# EAGLE board fmc-host (EAGLE 8.3.2), part 1 of 3
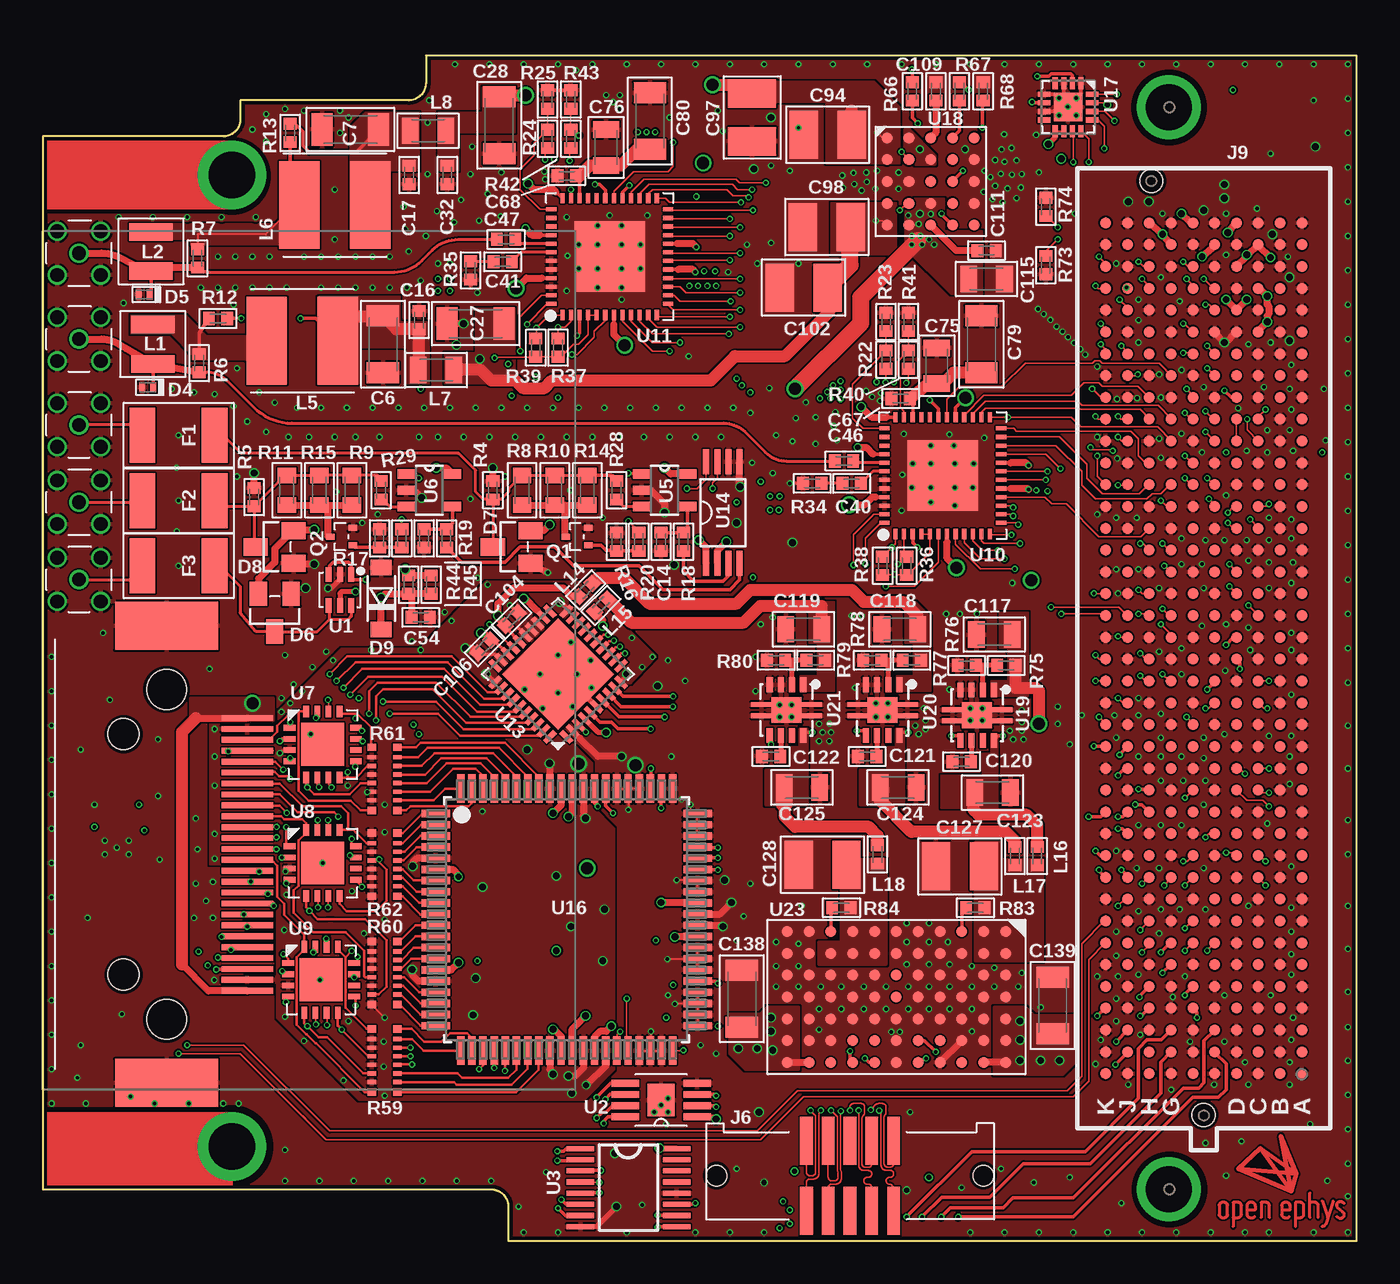
[diagram p9: board, top side]
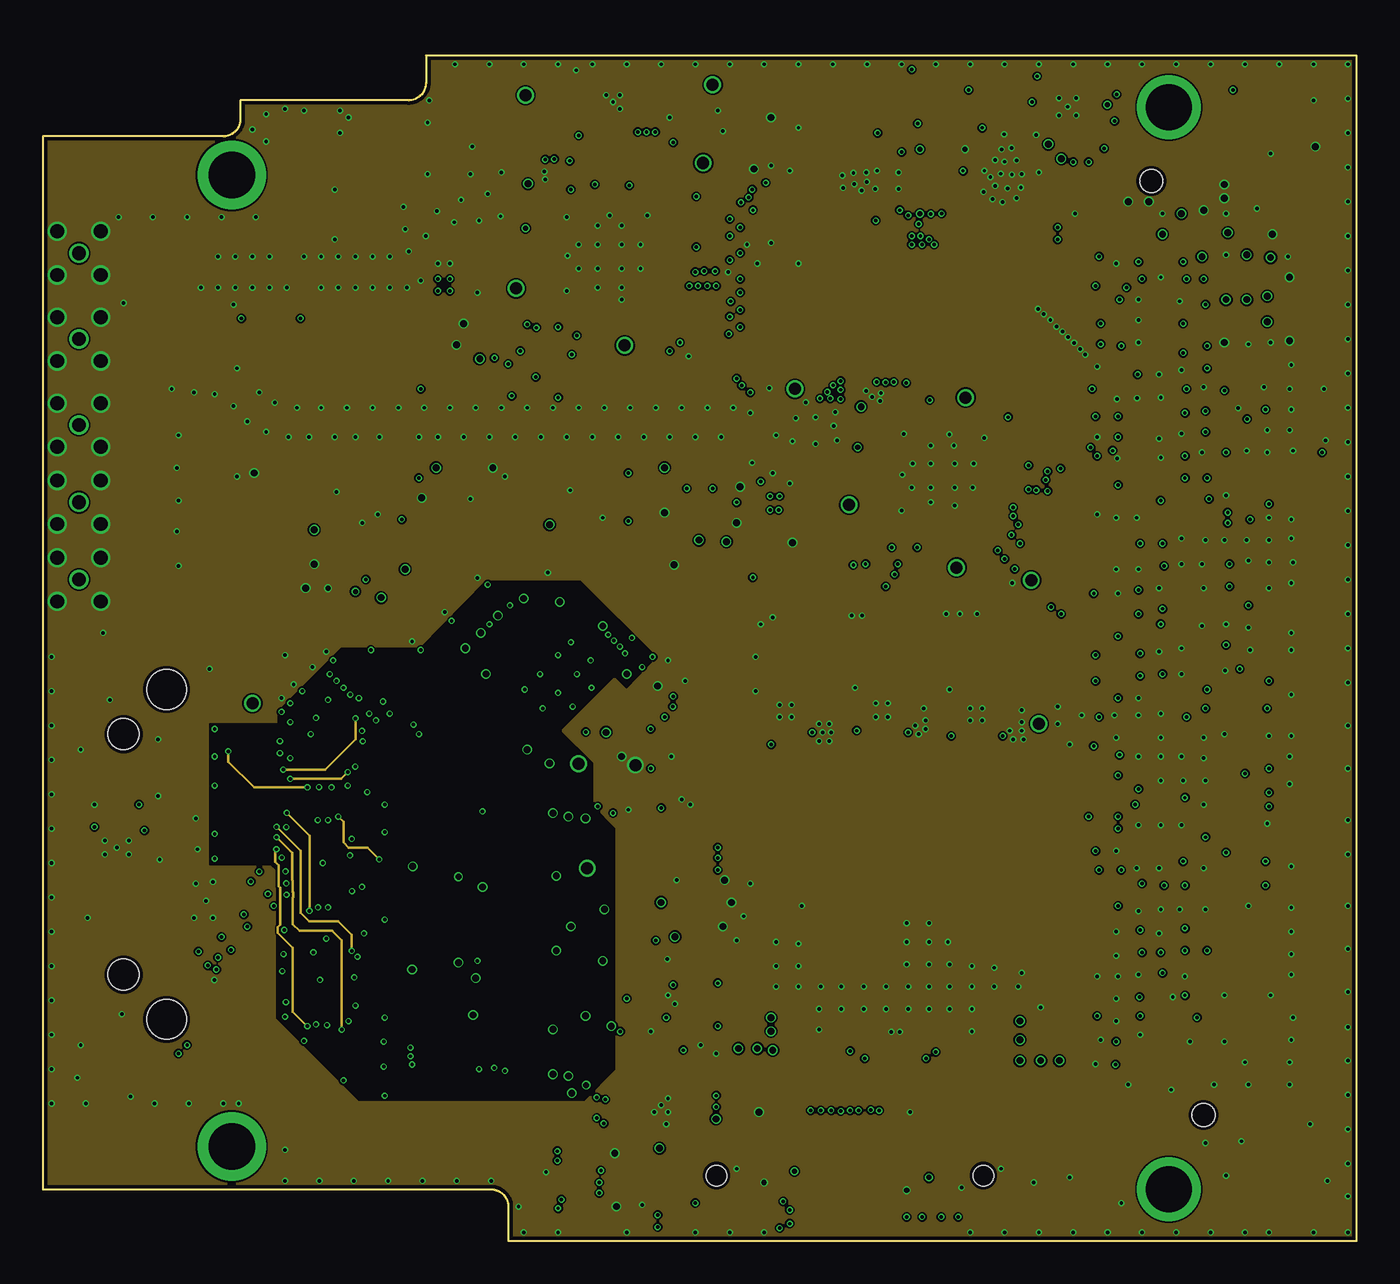
[diagram p10: board, inner layer GND1]
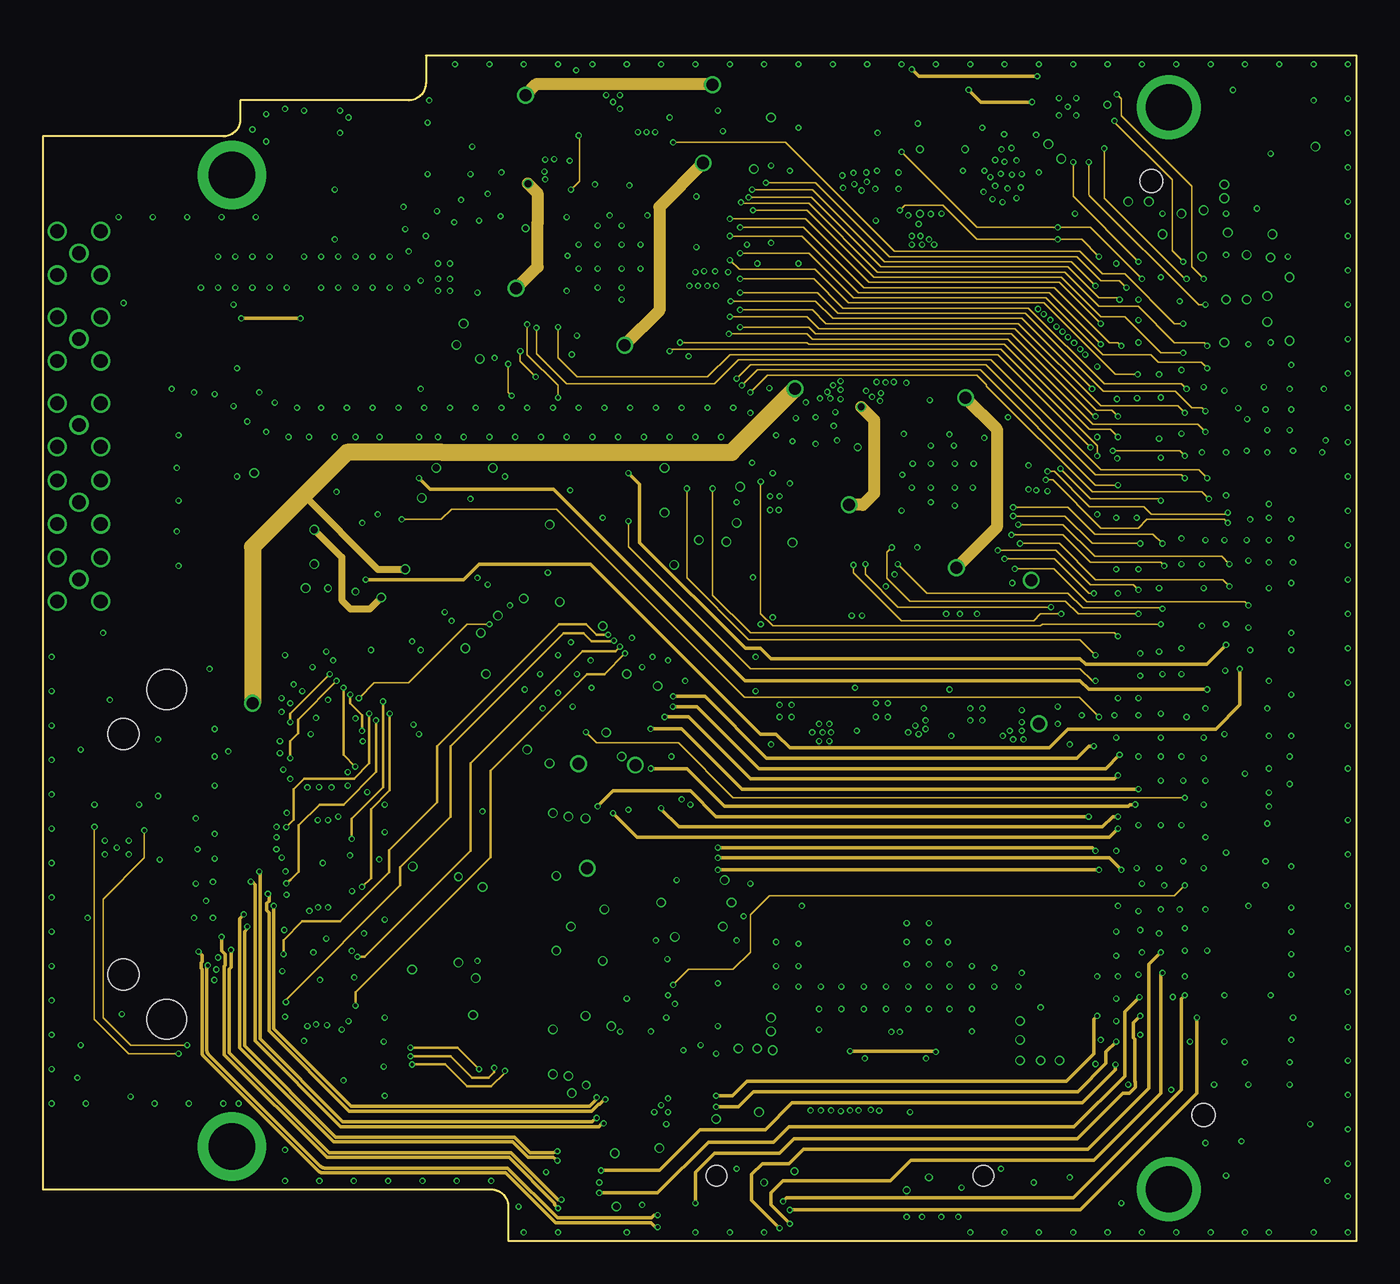
[diagram p11: board, inner layer Highspeed2]
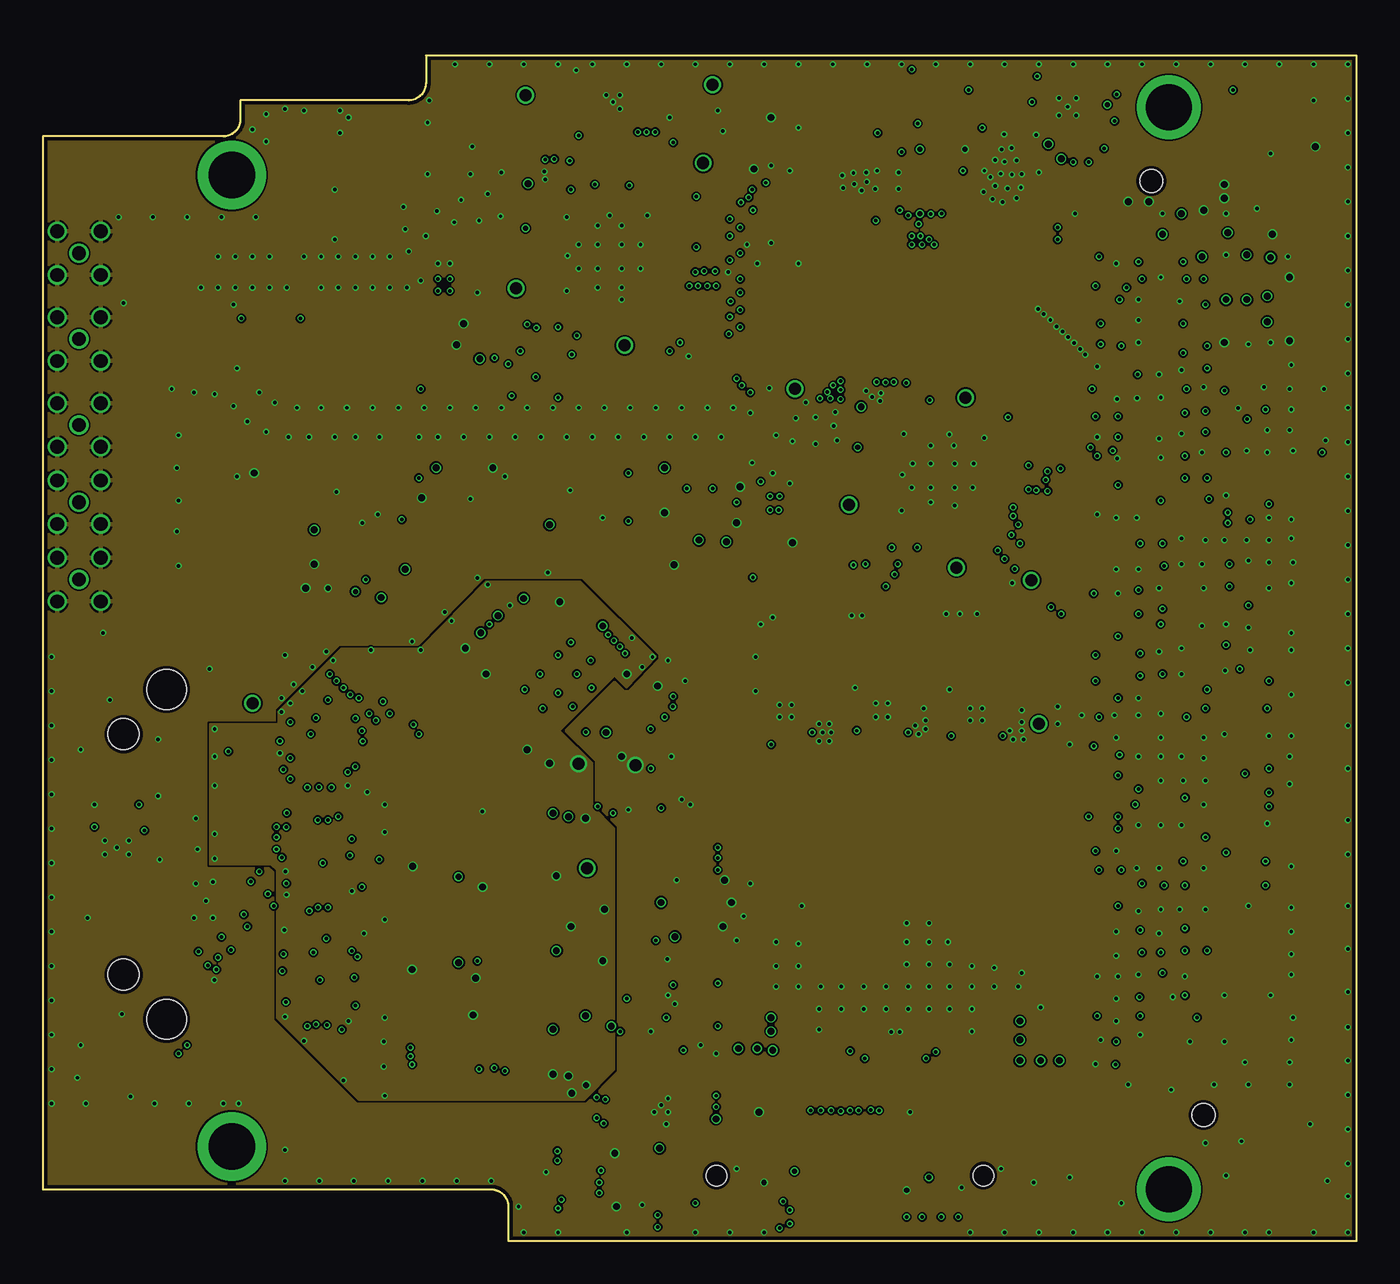
[diagram p12: board, inner layer GND3]
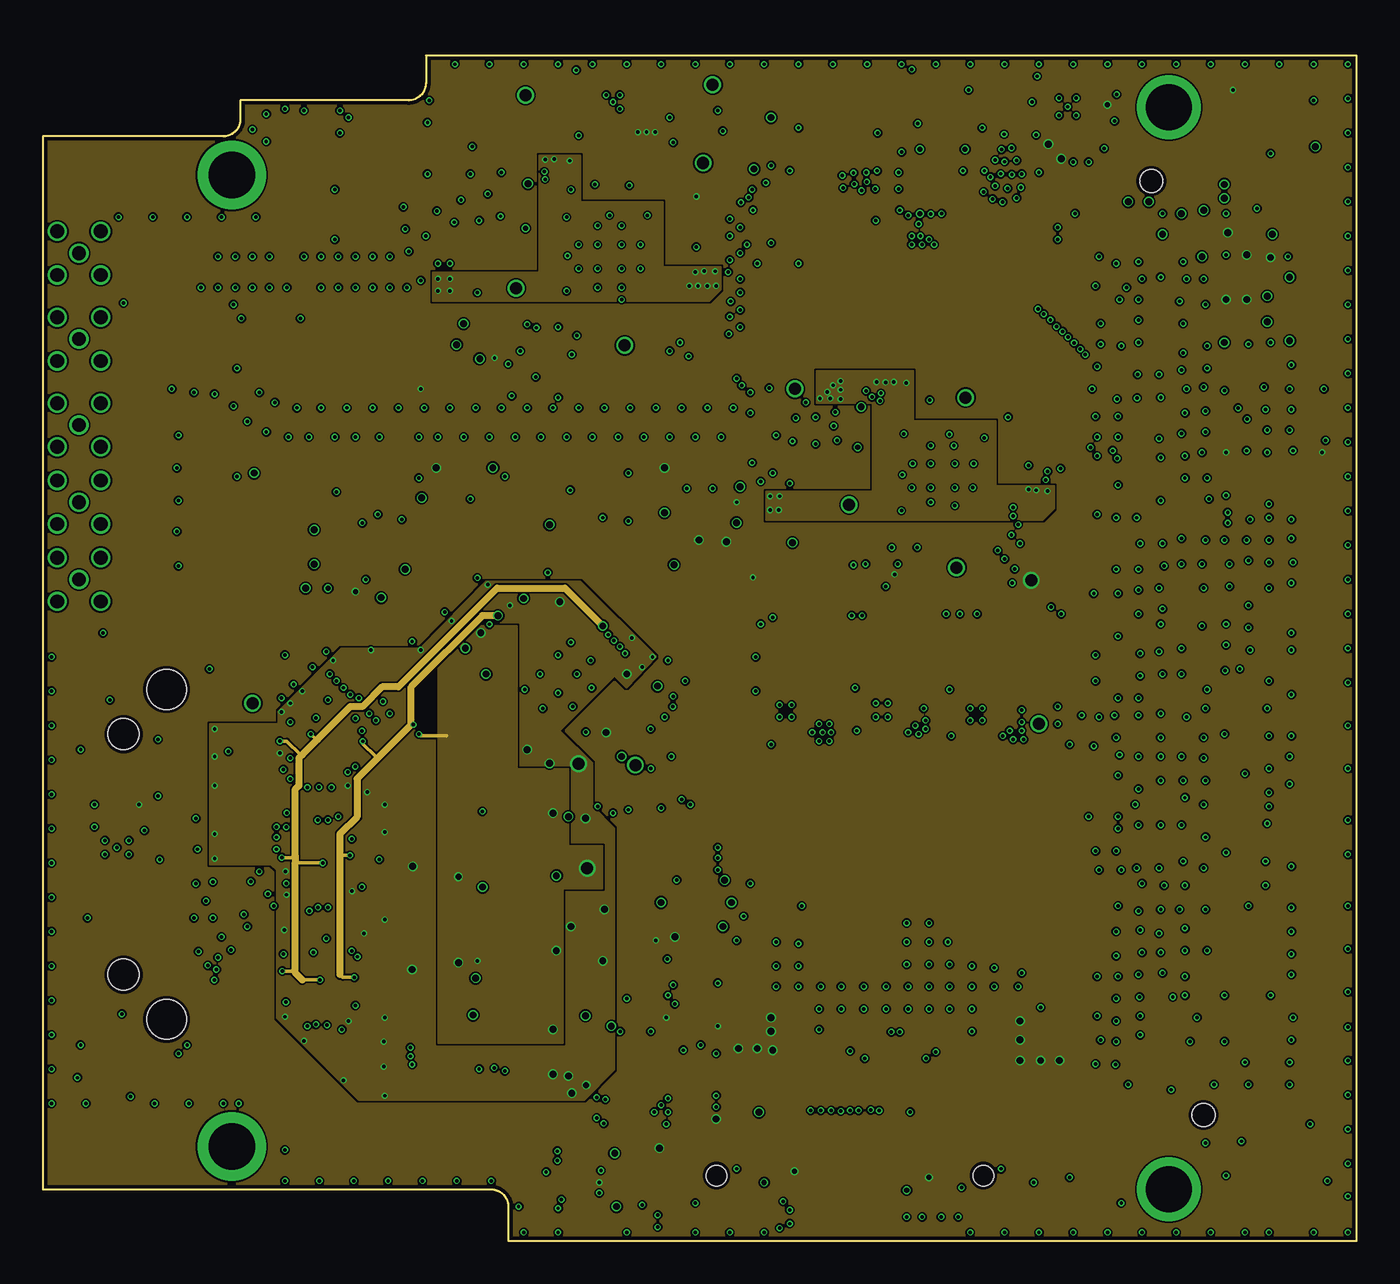
[diagram p13: board, inner layer VCC]
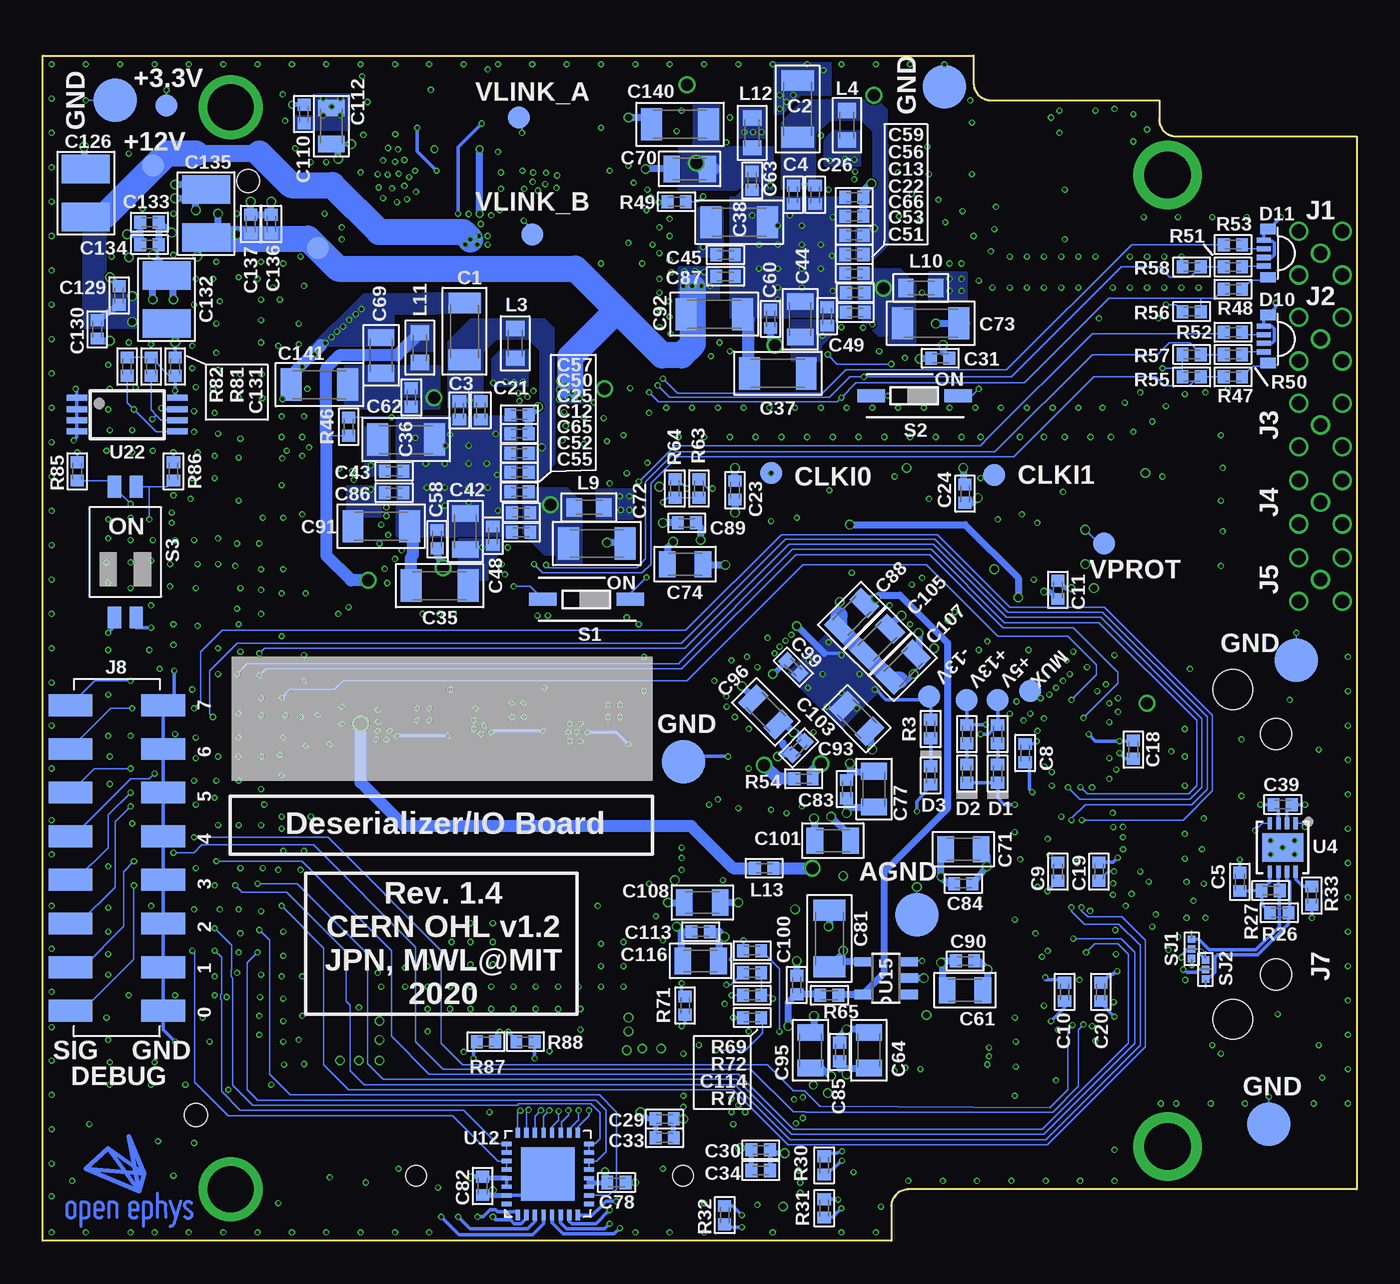
[diagram p14: board, bottom side, seen from below]

Size 76.5 x 69 mm. Coordinates in mm from the lower left corner, seen from the top.
Copper layers (1+2*3+4*5+16): Top/HighSpeed 0.035mm / dielectric 0.1mm / GND1 0.0175mm / dielectric 0.565mm / Highspeed2 0.0175mm / dielectric 5mil / GND3 0.0175mm / dielectric 0.565mm / VCC 0.0175mm / dielectric 0.1mm / Bottom/LowSpeed 0.035mm
Design rules "jlcpcb-6-layer *": minimum track width 3.5mil, minimum drill 0.2mm, track to track 3.5mil, track to pad 3.5mil, pad to pad 3.5mil, via to via 5mil, smd to smd 0mil, copper to edge 0.2mm, drill to drill 5mil, minimum pad ring 3mil, minimum via ring 3mil, stop-mask expansion 0mil, vias tented up to drill 100mil, thermal gap 0.12mm
Net classes: 1 130 Ohm Diff Top: width 0.09 mm, drill 0.2 mm, clearance 0.089 mm; 2 50 Ohm Single Top: width 0.15 mm, drill 0.2 mm; 3 100 Ohm Diff Mid: width 0.19 mm, drill 0.2 mm, clearance 0.09 mm; 4 50 Ohm Single Mid: width 0.2 mm, drill 0.2 mm; 5 100 Ohm Diff Top: width 0.15 mm, drill 0.2 mm, clearance 0.09 mm; 6 Link: width 0.15 mm, drill 0.2 mm, clearance 0.5 mm; 7 CAN 210 Diff Top: width 0.11 mm, drill 0.2 mm, clearance 0.09 mm
tRestrict: area -0.1,2.9 to 11.2,7.7; area 8.8,3.3 to 13.2,7.7; area 8.9,59.9 to 13.1,64.1; area -0.1,59.9 to 11.2,64.3; area 63.6,1 to 67.6,5; area 63.6,64 to 67.6,68

## Footprints (pad centres in the part's own frame; a part is rotated, then mirrored left to right if it is on the bottom)
1206 = smd 1.219 x 1.88: 1 -1.651,0; 2 1.651,0
0402 = smd 0.686 x 0.762: 1 -0.533,0; 2 0.533,0
0805 = smd 0.965 x 1.524: 1 -1.041,0; 2 1.041,0
1210 = smd 1.651 x 2.794: 1 -1.397,0; 2 1.397,0
LED-0402 = smd 0.762 x 0.686: A 0,-0.533; C 0,0.533
0402P-DFN = smd 0.35 x 0.6: A -0.325,0; C 0.325,0
SOT23 = smd 1 x 1.4: 1 -0.95,-1.1; 2 0.95,-1.1; 3 0,1.1
SOD123 = smd 0.914 x 1.219: A -1.8,0; C 1.8,0
RGB_LED_SMD-6 = smd 0.6 x 0.9: 1 1.4,0.65; 6 -1.4,0.65 | smd 0.3 x 0.8: 2 0.75,0.4; 3 0.25,0.4; 4 -0.25,0.4; 5 -0.75,0.4
1812 = smd 1.5 x 3.2: 1 -2.1,0; 2 2.1,0
MMCX-THRU = drill 0.8: GND@1 -1.27,1.27; GND@2 -1.27,-1.27; GND@3 1.27,-1.27; GND@4 1.27,1.27; SIG 0,0
ESHF-105-01-L-D-SM-K-TR = smd 0.74 x 2.8: 1 -2.54,-2.035; 2 -2.54,2.035; 3 -1.27,-2.035; 4 -1.27,2.035; 5 0,-2.035; 6 0,2.035; 7 1.27,-2.035; 8 1.27,2.035; 9 2.54,-2.035; 10 2.54,2.035 | hole 1.19: -7.77,0; 7.77,0
12226-82X0-00XX = smd 0.335 x 3: 1 7.938,7.2; 2 6.668,7.2; 3 5.397,7.2; 4 4.128,7.2; 5 2.857,7.2; 6 1.587,7.2; 7 0.318,7.2; 8 -0.953,7.2; 9 -2.223,7.2; 10 -3.493,7.2; 11 -4.763,7.2; 12 -6.032,7.2; 13 -7.303,7.2; 14 7.303,7.2; 15 6.032,7.2; 16 4.763,7.2; 17 3.493,7.2; 18 2.223,7.2; 19 0.953,7.2; 20 -0.318,7.2; 21 -1.587,7.2; 22 -2.857,7.2; 23 -4.128,7.2; 24 -5.397,7.2; 25 -6.668,7.2; 26 -7.938,7.2 | smd 2.8 x 6: PAD1 -13.3,2.5; PAD2 13.3,2.5 | hole 1.8: 7,0; -7,0 | hole 2.3: 9.6,2.5; -9.6,2.5
JP2X8_SMD = smd 1.27 x 2.54: 1 0,-2.7; 2 0,2.7; 3 2.54,-2.7; 4 2.54,2.7; 5 5.08,-2.7; 6 5.08,2.7; 7 7.62,-2.7; 8 7.62,2.7; 9 10.16,-2.7; 10 10.16,2.7; 11 12.7,-2.7; 12 12.7,2.7; 13 15.24,-2.7; 14 15.24,2.7; 15 17.78,-2.7; 16 17.78,2.7
FMC_HPC_MALE = smd 0.635 x 0.635: A1 24.765,5.715; A2 23.495,5.715; A3 22.225,5.715; A4 20.955,5.715; A5 19.685,5.715; A6 18.415,5.715; A7 17.145,5.715; A8 15.875,5.715; A9 14.605,5.715; A10 13.335,5.715; A11 12.065,5.715; A12 10.795,5.715; A13 9.525,5.715; A14 8.255,5.715; A15 6.985,5.715; A16 5.715,5.715; A17 4.445,5.715; A18 3.175,5.715; A19 1.905,5.715; A20 0.635,5.715; A21 -0.635,5.715; A22 -1.905,5.715; A23 -3.175,5.715; A24 -4.445,5.715; A25 -5.715,5.715; A26 -6.985,5.715; A27 -8.255,5.715; A28 -9.525,5.715; A29 -10.795,5.715; A30 -12.065,5.715; A31 -13.335,5.715; A32 -14.605,5.715; A33 -15.875,5.715; A34 -17.145,5.715; A35 -18.415,5.715; A36 -19.685,5.715; A37 -20.955,5.715; A38 -22.225,5.715; A39 -23.495,5.715; A40 -24.765,5.715; B1 24.765,4.445; B2 23.495,4.445; B3 22.225,4.445; B4 20.955,4.445; B5 19.685,4.445; B6 18.415,4.445; B7 17.145,4.445; B8 15.875,4.445; B9 14.605,4.445; B10 13.335,4.445; B11 12.065,4.445; B12 10.795,4.445; B13 9.525,4.445; B14 8.255,4.445; B15 6.985,4.445; B16 5.715,4.445; B17 4.445,4.445; B18 3.175,4.445; B19 1.905,4.445; B20 0.635,4.445; B21 -0.635,4.445; B22 -1.905,4.445; B23 -3.175,4.445; B24 -4.445,4.445; B25 -5.715,4.445; B26 -6.985,4.445; B27 -8.255,4.445; B28 -9.525,4.445; B29 -10.795,4.445; B30 -12.065,4.445; B31 -13.335,4.445; B32 -14.605,4.445; B33 -15.875,4.445; B34 -17.145,4.445; B35 -18.415,4.445; B36 -19.685,4.445; B37 -20.955,4.445; B38 -22.225,4.445; B39 -23.495,4.445; B40 -24.765,4.445; C1 24.765,3.175; C2 23.495,3.175; C3 22.225,3.175; C4 20.955,3.175; C5 19.685,3.175; C6 18.415,3.175; C7 17.145,3.175; C8 15.875,3.175; C9 14.605,3.175; C10 13.335,3.175; C11 12.065,3.175; C12 10.795,3.175; C13 9.525,3.175; C14 8.255,3.175; C15 6.985,3.175; C16 5.715,3.175; C17 4.445,3.175; C18 3.175,3.175; C19 1.905,3.175; C20 0.635,3.175; C21 -0.635,3.175; C22 -1.905,3.175; C23 -3.175,3.175; C24 -4.445,3.175; C25 -5.715,3.175; C26 -6.985,3.175; C27 -8.255,3.175; C28 -9.525,3.175; C29 -10.795,3.175; C30 -12.065,3.175; C31 -13.335,3.175; C32 -14.605,3.175; C33 -15.875,3.175; C34 -17.145,3.175; C35 -18.415,3.175; C36 -19.685,3.175; C37 -20.955,3.175; C38 -22.225,3.175; C39 -23.495,3.175; C40 -24.765,3.175; D1 24.765,1.905; D2 23.495,1.905; D3 22.225,1.905; D4 20.955,1.905; D5 19.685,1.905; D6 18.415,1.905; D7 17.145,1.905; D8 15.875,1.905; D9 14.605,1.905; D10 13.335,1.905; D11 12.065,1.905; D12 10.795,1.905; D13 9.525,1.905; D14 8.255,1.905; D15 6.985,1.905; D16 5.715,1.905; D17 4.445,1.905; D18 3.175,1.905; D19 1.905,1.905; D20 0.635,1.905; D21 -0.635,1.905; D22 -1.905,1.905; D23 -3.175,1.905; D24 -4.445,1.905; D25 -5.715,1.905; D26 -6.985,1.905; D27 -8.255,1.905; D28 -9.525,1.905; D29 -10.795,1.905; D30 -12.065,1.905; D31 -13.335,1.905; D32 -14.605,1.905; D33 -15.875,1.905; D34 -17.145,1.905; D35 -18.415,1.905; D36 -19.685,1.905; D37 -20.955,1.905; D38 -22.225,1.905; D39 -23.495,1.905; D40 -24.765,1.905; E1 24.765,0.635; E2 23.495,0.635; E3 22.225,0.635; E4 20.955,0.635; E5 19.685,0.635; E6 18.415,0.635; E7 17.145,0.635; E8 15.875,0.635; E9 14.605,0.635; E10 13.335,0.635; E11 12.065,0.635; E12 10.795,0.635; E13 9.525,0.635; E14 8.255,0.635; E15 6.985,0.635; E16 5.715,0.635; E17 4.445,0.635; E18 3.175,0.635; E19 1.905,0.635; E20 0.635,0.635; E21 -0.635,0.635; E22 -1.905,0.635; E23 -3.175,0.635; E24 -4.445,0.635; E25 -5.715,0.635; E26 -6.985,0.635; E27 -8.255,0.635; E28 -9.525,0.635; E29 -10.795,0.635; E30 -12.065,0.635; E31 -13.335,0.635; E32 -14.605,0.635; E33 -15.875,0.635; E34 -17.145,0.635; E35 -18.415,0.635; E36 -19.685,0.635; E37 -20.955,0.635; E38 -22.225,0.635; E39 -23.495,0.635; E40 -24.765,0.635; F1 24.765,-0.635; F2 23.495,-0.635; F3 22.225,-0.635; F4 20.955,-0.635; F5 19.685,-0.635; F6 18.415,-0.635; F7 17.145,-0.635; F8 15.875,-0.635; F9 14.605,-0.635; F10 13.335,-0.635; F11 12.065,-0.635; F12 10.795,-0.635; F13 9.525,-0.635; F14 8.255,-0.635; F15 6.985,-0.635; F16 5.715,-0.635; F17 4.445,-0.635; F18 3.175,-0.635; F19 1.905,-0.635; F20 0.635,-0.635; F21 -0.635,-0.635; F22 -1.905,-0.635; F23 -3.175,-0.635; F24 -4.445,-0.635; F25 -5.715,-0.635; F26 -6.985,-0.635; F27 -8.255,-0.635; F28 -9.525,-0.635; F29 -10.795,-0.635; F30 -12.065,-0.635; F31 -13.335,-0.635; F32 -14.605,-0.635; F33 -15.875,-0.635; F34 -17.145,-0.635; F35 -18.415,-0.635; F36 -19.685,-0.635; F37 -20.955,-0.635; F38 -22.225,-0.635; F39 -23.495,-0.635; F40 -24.765,-0.635; G1 24.765,-1.905; G2 23.495,-1.905; G3 22.225,-1.905; G4 20.955,-1.905; G5 19.685,-1.905; G6 18.415,-1.905; G7 17.145,-1.905; G8 15.875,-1.905; G9 14.605,-1.905; G10 13.335,-1.905; G11 12.065,-1.905; G12 10.795,-1.905; G13 9.525,-1.905; G14 8.255,-1.905; G15 6.985,-1.905; G16 5.715,-1.905; G17 4.445,-1.905; G18 3.175,-1.905; G19 1.905,-1.905; G20 0.635,-1.905; G21 -0.635,-1.905; G22 -1.905,-1.905; G23 -3.175,-1.905; G24 -4.445,-1.905; G25 -5.715,-1.905; G26 -6.985,-1.905; G27 -8.255,-1.905; G28 -9.525,-1.905; G29 -10.795,-1.905; G30 -12.065,-1.905; G31 -13.335,-1.905; G32 -14.605,-1.905; G33 -15.875,-1.905; G34 -17.145,-1.905; G35 -18.415,-1.905; G36 -19.685,-1.905; G37 -20.955,-1.905; G38 -22.225,-1.905; G39 -23.495,-1.905; G40 -24.765,-1.905; H1 24.765,-3.175; H2 23.495,-3.175; H3 22.225,-3.175; H4 20.955,-3.175; H5 19.685,-3.175; H6 18.415,-3.175; H7 17.145,-3.175; H8 15.875,-3.175; H9 14.605,-3.175; H10 13.335,-3.175; H11 12.065,-3.175; H12 10.795,-3.175; H13 9.525,-3.175; H14 8.255,-3.175; H15 6.985,-3.175; H16 5.715,-3.175; H17 4.445,-3.175; H18 3.175,-3.175; H19 1.905,-3.175; H20 0.635,-3.175; H21 -0.635,-3.175; H22 -1.905,-3.175; H23 -3.175,-3.175; H24 -4.445,-3.175; H25 -5.715,-3.175; H26 -6.985,-3.175; H27 -8.255,-3.175; H28 -9.525,-3.175; H29 -10.795,-3.175; H30 -12.065,-3.175; H31 -13.335,-3.175; H32 -14.605,-3.175; H33 -15.875,-3.175; H34 -17.145,-3.175; H35 -18.415,-3.175; H36 -19.685,-3.175; H37 -20.955,-3.175; H38 -22.225,-3.175; H39 -23.495,-3.175; H40 -24.765,-3.175; J1 24.765,-4.445; J2 23.495,-4.445; J3 22.225,-4.445; J4 20.955,-4.445; J5 19.685,-4.445; J6 18.415,-4.445; J7 17.145,-4.445; J8 15.875,-4.445; J9 14.605,-4.445; J10 13.335,-4.445; J11 12.065,-4.445; J12 10.795,-4.445; J13 9.525,-4.445; J14 8.255,-4.445; J15 6.985,-4.445; J16 5.715,-4.445; J17 4.445,-4.445; J18 3.175,-4.445; J19 1.905,-4.445; J20 0.635,-4.445; J21 -0.635,-4.445; J22 -1.905,-4.445; J23 -3.175,-4.445; J24 -4.445,-4.445; J25 -5.715,-4.445; J26 -6.985,-4.445; J27 -8.255,-4.445; J28 -9.525,-4.445; J29 -10.795,-4.445; J30 -12.065,-4.445; J31 -13.335,-4.445; J32 -14.605,-4.445; J33 -15.875,-4.445; J34 -17.145,-4.445; J35 -18.415,-4.445; J36 -19.685,-4.445; J37 -20.955,-4.445; J38 -22.225,-4.445; J39 -23.495,-4.445; J40 -24.765,-4.445; K1 24.765,-5.715; K2 23.495,-5.715; K3 22.225,-5.715; K4 20.955,-5.715; K5 19.685,-5.715; K6 18.415,-5.715; K7 17.145,-5.715; K8 15.875,-5.715; K9 14.605,-5.715; K10 13.335,-5.715; K11 12.065,-5.715; K12 10.795,-5.715; K13 9.525,-5.715; K14 8.255,-5.715; K15 6.985,-5.715; K16 5.715,-5.715; K17 4.445,-5.715; K18 3.175,-5.715; K19 1.905,-5.715; K20 0.635,-5.715; K21 -0.635,-5.715; K22 -1.905,-5.715; K23 -3.175,-5.715; K24 -4.445,-5.715; K25 -5.715,-5.715; K26 -6.985,-5.715; K27 -8.255,-5.715; K28 -9.525,-5.715; K29 -10.795,-5.715; K30 -12.065,-5.715; K31 -13.335,-5.715; K32 -14.605,-5.715; K33 -15.875,-5.715; K34 -17.145,-5.715; K35 -18.415,-5.715; K36 -19.685,-5.715; K37 -20.955,-5.715; K38 -22.225,-5.715; K39 -23.495,-5.715; K40 -24.765,-5.715 | drill 2.692: GNDA -31.496,-2.032; GNDB 31.496,-2.032 | hole 1.321: 27.165,0; -27.191,-3.05
1008PS = smd 2.54 x 1.016: 1 0,1.143; 2 0,-1.143
0603 = smd 0.889 x 1.067: 1 -0.864,0; 2 0.864,0
SRN6045TA = smd 5.1 x 2.35: 1 0,2.075; 2 0,-2.075
SC75 = smd 0.356 x 0.503: 1 -0.508,-0.65; 2 0.508,-0.65; 3 0,0.65
RN2X8-1506 = smd 0.425 x 0.5: 1 -1.837,-0.75; 8 1.837,-0.75; C1 -1.837,0.75; C8 1.837,0.75 | smd 0.25 x 0.5: 2 -1.25,-0.75; 3 -0.75,-0.75; 4 -0.25,-0.75; 5 0.25,-0.75; 6 0.75,-0.75; 7 1.25,-0.75; C2 -1.25,0.75; C3 -0.75,0.75; C4 -0.25,0.75; C5 0.25,0.75; C6 0.75,0.75; C7 1.25,0.75
DIP01-SMD-GULL = smd 0.76 x 1.6: 1 0,-5.08; 2 0,0
CHS-02TB = smd 0.76 x 1.27: 1 -0.635,-3.81; 2 0.635,-3.81; 3 0.635,3.81; 4 -0.635,3.81
SJ_2_0201 = smd 0.432 x 0.432: 1 -0.559,0; 2 0.559,0; COM 0,0
B1,27 = smd 1.27 x 1.27: TP 0,0
B2,54 = smd 2.54 x 2.54: TP 0,0
SC70 = smd 0.35 x 0.85: 1 -0.65,-0.9; 2 0,-0.9; 3 0.65,-0.9; 4 0.65,0.9; 5 0,0.9; 6 -0.65,0.9
MSOP-8-PAD-3X3 = smd 1.6 x 0.4: 1 -2.1,0.975; 2 -2.1,0.325; 3 -2.1,-0.325; 4 -2.1,-0.975; 5 2.1,-0.325; 6 2.1,-0.975; 7 2.1,0.325; 8 2.1,0.975 | smd 1.57 x 1.89: PAD 0,0
TSSOP-16 = smd 1.6 x 0.3: 1 -2.8,2.275; 2 -2.8,1.625; 3 -2.8,0.975; 4 -2.8,0.325; 5 -2.8,-0.325; 6 -2.8,-0.975; 7 -2.8,-1.625; 8 -2.8,-2.275; 9 2.8,-2.275; 10 2.8,-1.625; 11 2.8,-0.975; 12 2.8,-0.325; 13 2.8,0.325; 14 2.8,0.975; 15 2.8,1.625; 16 2.8,2.275
DFN83X3 = smd 0.7 x 0.25: 1 -1.4,0.75; 2 -1.4,0.25; 3 -1.4,-0.25; 4 -1.4,-0.75; 5 1.4,-0.75; 6 1.4,-0.25; 7 1.4,0.25; 8 1.4,0.75 | smd 1.65 x 2.38: PAD 0,0
SOT-23-5 = smd 0.55 x 1: 1 -0.95,-1.35; 2 0,-1.35; 3 0.95,-1.35; 4 0.95,1.35; 5 -0.95,1.35
QFN16-4X4MM = smd 0.686 x 0.33: 1 -1.925,0.975; 2 -1.925,0.325; 3 -1.925,-0.325; 4 -1.925,-0.975; 9 1.925,-0.975; 10 1.925,-0.325; 11 1.925,0.325; 12 1.925,0.975 | smd 0.33 x 0.686: 5 -0.975,-1.925; 6 -0.325,-1.925; 7 0.325,-1.925; 8 0.975,-1.925; 13 0.975,1.925; 14 0.325,1.925; 15 -0.325,1.925; 16 -0.975,1.925 | smd 2.5 x 2.5: PAD 0,0
WQFN48-7X7-PAD = smd 0.24 x 0.6: 1 2.75,3.4; 2 2.25,3.4; 3 1.75,3.4; 4 1.25,3.4; 5 0.75,3.4; 6 0.25,3.4; 7 -0.25,3.4; 8 -0.75,3.4; 9 -1.25,3.4; 10 -1.75,3.4; 11 -2.25,3.4; 12 -2.75,3.4; 25 -2.75,-3.4; 26 -2.25,-3.4; 27 -1.75,-3.4; 28 -1.25,-3.4; 29 -0.75,-3.4; 30 -0.25,-3.4; 31 0.25,-3.4; 32 0.75,-3.4; 33 1.25,-3.4; 34 1.75,-3.4; 35 2.25,-3.4; 36 2.75,-3.4 | smd 0.6 x 0.24: 13 -3.4,2.75; 14 -3.4,2.25; 15 -3.4,1.75; 16 -3.4,1.25; 17 -3.4,0.75; 18 -3.4,0.25; 19 -3.4,-0.25; 20 -3.4,-0.75; 21 -3.4,-1.25; 22 -3.4,-1.75; 23 -3.4,-2.25; 24 -3.4,-2.75; 37 3.4,-2.75; 38 3.4,-2.25; 39 3.4,-1.75; 40 3.4,-1.25; 41 3.4,-0.75; 42 3.4,-0.25; 43 3.4,0.25; 44 3.4,0.75; 45 3.4,1.25; 46 3.4,1.75; 47 3.4,2.25; 48 3.4,2.75 | smd 4.1 x 4.1: PAD 0,0
WQFN32-5X5 = smd 0.25 x 0.6: 1 1.75,2.4; 2 1.25,2.4; 3 0.75,2.4; 4 0.25,2.4; 5 -0.25,2.4; 6 -0.75,2.4; 7 -1.25,2.4; 8 -1.75,2.4; 17 -1.75,-2.4; 18 -1.25,-2.4; 19 -0.75,-2.4; 20 -0.25,-2.4; 21 0.25,-2.4; 22 0.75,-2.4; 23 1.25,-2.4; 24 1.75,-2.4 | smd 0.6 x 0.25: 9 -2.4,1.75; 10 -2.4,1.25; 11 -2.4,0.75; 12 -2.4,0.25; 13 -2.4,-0.25; 14 -2.4,-0.75; 15 -2.4,-1.25; 16 -2.4,-1.75; 25 2.4,-1.75; 26 2.4,-1.25; 27 2.4,-0.75; 28 2.4,-0.25; 29 2.4,0.25; 30 2.4,0.75; 31 2.4,1.25; 32 2.4,1.75 | smd 3.1 x 3.1: PAD 0,0
CP_40_7 = smd 0.855 x 0.3: 1 -2.927,2.25; 2 -2.927,1.75; 3 -2.927,1.25; 4 -2.927,0.75; 5 -2.927,0.25; 6 -2.927,-0.25; 7 -2.927,-0.75; 8 -2.927,-1.25; 9 -2.927,-1.75; 10 -2.927,-2.25; 21 2.927,-2.25; 22 2.927,-1.75; 23 2.927,-1.25; 24 2.927,-0.75; 25 2.927,-0.25; 26 2.927,0.25; 27 2.927,0.75; 28 2.927,1.25; 29 2.927,1.75; 30 2.927,2.25 | smd 0.3 x 0.855: 11 -2.25,-2.927; 12 -1.75,-2.927; 13 -1.25,-2.927; 14 -0.75,-2.927; 15 -0.25,-2.927; 16 0.25,-2.927; 17 0.75,-2.927; 18 1.25,-2.927; 19 1.75,-2.927; 20 2.25,-2.927; 31 2.25,2.927; 32 1.75,2.927; 33 1.25,2.927; 34 0.75,2.927; 35 0.25,2.927; 36 -0.25,2.927; 37 -0.75,2.927; 38 -1.25,2.927; 39 -1.75,2.927; 40 -2.25,2.927 | smd 4.6 x 4.6: PAD 0,0
TSSOP-8 = smd 0.348 x 1.45: 1 -0.973,-2.95; 2 -0.323,-2.95; 3 0.327,-2.95; 4 0.977,-2.95; 5 0.977,2.95; 6 0.327,2.95; 7 -0.323,2.95; 8 -0.973,2.95
ST_80_2 = smd 1.661 x 0.432: 1 -7.625,6.175; 2 -7.625,5.525; 3 -7.625,4.875; 4 -7.625,4.225; 5 -7.625,3.575; 6 -7.625,2.925; 7 -7.625,2.275; 8 -7.625,1.625; 9 -7.625,0.975; 10 -7.625,0.325; 11 -7.625,-0.325; 12 -7.625,-0.975; 13 -7.625,-1.625; 14 -7.625,-2.275; 15 -7.625,-2.925; 16 -7.625,-3.575; 17 -7.625,-4.225; 18 -7.625,-4.875; 19 -7.625,-5.525; 20 -7.625,-6.175; 41 7.625,-6.175; 42 7.625,-5.525; 43 7.625,-4.875; 44 7.625,-4.225; 45 7.625,-3.575; 46 7.625,-2.925; 47 7.625,-2.275; 48 7.625,-1.625; 49 7.625,-0.975; 50 7.625,-0.325; 51 7.625,0.325; 52 7.625,0.975; 53 7.625,1.625; 54 7.625,2.275; 55 7.625,2.925; 56 7.625,3.575; 57 7.625,4.225; 58 7.625,4.875; 59 7.625,5.525; 60 7.625,6.175 | smd 0.432 x 1.661: 21 -6.175,-7.625; 22 -5.525,-7.625; 23 -4.875,-7.625; 24 -4.225,-7.625; 25 -3.575,-7.625; 26 -2.925,-7.625; 27 -2.275,-7.625; 28 -1.625,-7.625; 29 -0.975,-7.625; 30 -0.325,-7.625; 31 0.325,-7.625; 32 0.975,-7.625; 33 1.625,-7.625; 34 2.275,-7.625; 35 2.925,-7.625; 36 3.575,-7.625; 37 4.225,-7.625; 38 4.875,-7.625; 39 5.525,-7.625; 40 6.175,-7.625; 61 6.175,7.625; 62 5.525,7.625; 63 4.875,7.625; 64 4.225,7.625; 65 3.575,7.625; 66 2.925,7.625; 67 2.275,7.625; 68 1.625,7.625; 69 0.975,7.625; 70 0.325,7.625; 71 -0.325,7.625; 72 -0.975,7.625; 73 -1.625,7.625; 74 -2.275,7.625; 75 -2.925,7.625; 76 -3.575,7.625; 77 -4.225,7.625; 78 -4.875,7.625; 79 -5.525,7.625; 80 -6.175,7.625
CP_16_27-L = smd 0.711 x 0.305: 1 -1.397,0.75; 2 -1.397,0.25; 3 -1.397,-0.25; 4 -1.397,-0.75; 9 1.397,-0.75; 10 1.397,-0.25; 11 1.397,0.25; 12 1.397,0.75 | smd 0.305 x 0.711: 5 -0.75,-1.397; 6 -0.25,-1.397; 7 0.25,-1.397; 8 0.75,-1.397; 13 0.75,1.397; 14 0.25,1.397; 15 -0.25,1.397; 16 -0.75,1.397 | smd 1.651 x 1.651: PAD 0,0
BGA_5X5_625X625 = smd 0.635 x 0.635: A1 -2.54,2.54; A2 -1.27,2.54; A3 0,2.54; A4 1.27,2.54; A5 2.54,2.54; B1 -2.54,1.27; B2 -1.27,1.27; B3 0,1.27; B4 1.27,1.27; B5 2.54,1.27; C1 -2.54,0; C2 -1.27,0; C3 0,0; C4 1.27,0; C5 2.54,0; D1 -2.54,-1.27; D2 -1.27,-1.27; D3 0,-1.27; D4 1.27,-1.27; D5 2.54,-1.27; E1 -2.54,-2.54; E2 -1.27,-2.54; E3 0,-2.54; E4 1.27,-2.54; E5 2.54,-2.54
PVSON-N8+4-3X3 = smd 0.85 x 0.35: 1 -1.475,0.975; 2 -1.475,0.325; 3 -1.475,-0.325; 4 -1.475,-0.975; 5 1.475,-0.975; 6 1.475,-0.325; 7 1.475,0.325; 8 1.475,0.975 | smd 1.5 x 1.75: PAD1 0,0 | smd 0.28 x 1.205: PAD2 -0.325,-1.45; PAD3 -0.325,1.45; PAD4 0.325,1.45; PAD5 0.325,-1.45
TSSOP8 = smd 0.35 x 1.2: 1 -0.975,-2.925; 2 -0.325,-2.925; 3 0.325,-2.925; 4 0.975,-2.925; 5 0.975,2.925; 6 0.325,2.925; 7 -0.325,2.925; 8 -0.975,2.925
LTM8049 = smd 0.63 x 0.63: A1 -3.81,6.35; A2 -2.54,6.35; A3 -1.27,6.35; A4 0,6.35; A5 1.27,6.35; A6 2.54,6.35; A7 3.81,6.35; B1 -3.81,5.08; B2 -2.54,5.08; B3 -1.27,5.08; B4 0,5.08; B5 1.27,5.08; B6 2.54,5.08; B7 3.81,5.08; C1 -3.81,3.81; C2 -2.54,3.81; C3 -1.27,3.81; C4 0,3.81; C5 1.27,3.81; C6 2.54,3.81; C7 3.81,3.81; D1 -3.81,2.54; D2 -2.54,2.54; D3 -1.27,2.54; D4 0,2.54; D5 1.27,2.54; D6 2.54,2.54; D7 3.81,2.54; E1 -3.81,1.27; E2 -2.54,1.27; E3 -1.27,1.27; E4 0,1.27; E5 1.27,1.27; E6 2.54,1.27; E7 3.81,1.27; F1 -3.81,0; F2 -2.54,0; F3 -1.27,0; F4 0,0; F5 1.27,0; F6 2.54,0; F7 3.81,0; G1 -3.81,-1.27; G2 -2.54,-1.27; G3 -1.27,-1.27; G4 0,-1.27; G5 1.27,-1.27; G6 2.54,-1.27; G7 3.81,-1.27; H1 -3.81,-2.54; H2 -2.54,-2.54; H3 -1.27,-2.54; H4 0,-2.54; H5 1.27,-2.54; H6 2.54,-2.54; H7 3.81,-2.54; J1 -3.81,-3.81; J2 -2.54,-3.81; J3 -1.27,-3.81; J4 0,-3.81; J5 1.27,-3.81; J6 2.54,-3.81; J7 3.81,-3.81; K1 -3.81,-5.08; K2 -2.54,-5.08; K3 -1.27,-5.08; K4 0,-5.08; K5 1.27,-5.08; K6 2.54,-5.08; K7 3.81,-5.08; L1 -3.81,-6.35; L2 -2.54,-6.35; L3 -1.27,-6.35; L4 0,-6.35; L5 1.27,-6.35; L6 2.54,-6.35; L7 3.81,-6.35
FMC_SINGLE_WIDTH_MODULE = drill 2.7 pad 4: BEZ1 -54.6,59.05; BEZ2 -54.6,2.5

## Placement (x,y rotation side)
C1  10uF  [1206]  51.95,52.95 270 bottom
C2  10uF  [1206]  32.55,65.9 270 bottom
C3  0.1uF  [0402]  52.25,48.35 90 bottom
C4  0.1uF  [0402]  32.8,60.9 90 bottom
C5  4.7nF  [0402]  6.8,20.9 90 bottom
C6  10uF  [1206]  19.8,52.2 90 top
C7  10uF  [1206]  17.9,64.7 0 top
C8  0.1uF  [0402]  19.3,28.4 90 bottom
C9  0.1uF  [0402]  17.4,21.5 90 bottom
C10  0.1uF  [0402]  17,14.5 90 bottom
C11  0.1uF  [0402]  17.4,37.9 270 bottom
C12  10nF  [0402]  48.75,44.75 0 bottom
C13  10nF  [0402]  29.25,58.55 0 bottom
C14  0.1uF  [0402]  36,40.7 270 top
C15  0.1uF  [0402]  22.2,40.9 270 top
C16  0.1uF  [0402]  21.9,53.6 90 top
C17  0.1uF  [0402]  21.33,62.05 270 top
C18  0.1uF  [0402]  13,28.6 90 bottom
C19  0.1uF  [0402]  15,21.5 90 bottom
C20  0.1uF  [0402]  14.9,14.5 90 bottom
C21  10nF  [0402]  51,48.35 90 bottom
C22  10nF  [0402]  29.25,57.42 0 bottom
C23  0.1uF  [0402]  36.2,43.7 270 bottom
C24  0.1uF  [0402]  22.8,43.5 270 bottom
C25  10nF  [0402]  48.75,45.85 0 bottom
C26  10nF  [0402]  31.52,60.9 90 bottom
C27  10uF  [1206]  25.2,53.4 0 top
C28  10uF  [1206]  26.57,64.95 90 top
C29  4.7nF  [0402]  40.3,7.1 180 bottom
C30  4.7nF  [0402]  34.7,5.3 0 bottom
C31  0.1uF  [0402]  24.24,51.38 0 bottom
C32  0.1uF  [0402]  23.55,62.05 270 top
C33  0.1uF  [0402]  40.3,6 180 bottom
C34  0.1uF  [0402]  34.7,4.1 0 bottom
C35  10uF  [1206]  53.4,38.15 0 bottom
C36  10uF  [1206]  55.35,46.65 180 bottom
C37  10uF  [1206]  33.7,50.5 0 bottom
C38  10uF  [1206]  35.95,59.3 180 bottom
C39  0.1uF  [0402]  4.3,25.4 0 bottom
C40  47nF  [0402]  47.1,44.1 180 top
C41  47nF  [0402]  26.77,57 180 top
C42  1uF  [0805]  51.9,41.3 270 bottom
C43  0.1uF  [0402]  56.05,44.8 180 bottom
C44  1uF  [0805]  32.4,53.65 270 bottom
C45  0.1uF  [0402]  36.75,57.4 180 bottom
C46  0.1uF  [0402]  46.65,45.4 180 top
C47  0.1uF  [0402]  26.97,58.3 180 top
C48  0.1uF  [0402]  50.3,41.05 270 bottom
C49  0.1uF  [0402]  30.83,53.83 270 bottom
C50  0.1uF  [0402]  48.75,47 0 bottom
C51  0.1uF  [0402]  29.2,54.05 0 bottom
C52  10nF  [0402]  48.65,42.4 0 bottom
C53  10nF  [0402]  29.2,55.2 0 bottom
C54  0.1uF  [0402]  22,36.3 180 top
C55  0.1uF  [0402]  48.65,41.25 0 bottom
C56  0.1uF  [0402]  29.25,59.65 0 bottom
C57  10nF  [0402]  48.75,48.1 0 bottom
C58  0.1uF  [0402]  53.55,40.85 270 bottom
C59  10nF  [0402]  29.25,60.75 0 bottom
C60  0.1uF  [0402]  34.12,53.67 270 bottom
C61  10uF  [0805]  22.8,14.6 180 bottom
C62  0.1uF  [0402]  55.05,49.1 90 bottom
C63  0.1uF  [0402]  35.2,61.72 90 bottom
C64  10uF  [0805]  28.4,11.1 90 bottom
C65  0.1uF  [0402]  48.75,43.6 0 bottom
C66  0.1uF  [0402]  29.25,56.33 0 bottom
C67  0.1uF  [0402]  49.95,49.04 0 top
C68  0.1uF  [0402]  30.5,62 0 top
C69  1uF  [0805]  56.8,51.55 270 bottom
C70  1uF  [0805]  38.84,62.41 0 bottom
C71  10uF  [0805]  22.9,22.8 180 bottom
C72  10uF  [1206]  44.25,40.6 180 bottom
C73  10uF  [1206]  24.8,53.42 180 bottom
C74  1uF  [0805]  39.1,39.4 180 bottom
C75  1uF  [0805]  52.05,50.95 270 top
C76  1uF  [0805]  32.8,63.65 270 top
C77  10uF  [0805]  28.1,26.3 270 bottom
C78  0.1uF  [0402]  43.1,3.4 180 bottom
C79  10uF  [1206]  54.65,52.2 270 top
C80  10uF  [1206]  35.35,65.2 270 top
C81  10uF  [1206]  30.7,17.6 90 bottom
C82  10nF  [0402]  50.9,3.2 90 bottom
C83  0.1uF  [0402]  29.7,26.3 270 bottom
C84  0.1uF  [0402]  22.9,20.8 180 bottom
C85  0.1uF  [0402]  30.1,11 90 bottom
C86  0.1uF  [0402]  56.05,43.55 180 bottom
C87  0.1uF  [0402]  36.75,56.15 180 bottom
C88  1uF  [0805]  29.4,36.4 45 bottom
C89  0.1uF  [0402]  39,41.8 0 bottom
C90  0.1uF  [0402]  22.8,16.3 180 bottom
C91  10uF  [1206]  56.8,41.6 180 bottom
C92  10uF  [1206]  37.4,53.95 180 bottom
C93  0.1uF  [0402]  32.5,28.7 45 bottom
C94  47uF  [1210]  45.7,64.4 0 top
C95  10uF  [0805]  31.8,11.1 90 bottom
C96  10uF  [0805]  34.4,30.8 315 bottom
C97  47uF  [1210]  41.3,65.4 90 top
C98  47uF  [1210]  45.65,59.02 0 top
C99  0.1uF  [0402]  32.8,33.4 315 bottom
C100  0.1uF  [0402]  32.6,14.9 270 bottom
C101  10uF  [0805]  30.5,23.3 0 bottom
C102  47uF  [1210]  44.3,55.5 0 top
C103  10uF  [0805]  29.1,30.4 135 bottom
C104  0.1uF  [0402]  27.3,36.2 225 top
C105  10uF  [0805]  27.9,34.9 45 bottom
C106  0.1uF  [0402]  25.7,34.6 45 top
C107  10uF  [0805]  26.4,33.4 45 bottom
C108  10uF  [0805]  38.1,19.7 0 bottom
C109  0.1uF  [0402]  52,66.92 270 top
C110  0.1uF  [0402]  61.3,65.6 90 bottom
C111  0.1uF  [0402]  54.95,57.65 180 top
C112  10uF  [0805]  59.7,64.9 270 bottom
C113  0.1uF  [0402]  38.2,18 0 bottom
C114  0.1uF  [0402]  35.2,14.3 180 bottom
C115  10uF  [0805]  54.95,56 180 top
C116  10uF  [0805]  38.2,16.3 0 bottom
C117  10uF  [0805]  55.4,35.3 0 top
C118  10uF  [0805]  49.9,35.6 0 top
C119  10uF  [0805]  44.3,35.6 0 top
C120  10nF  [0402]  53.5,27.9 180 top
C121  10nF  [0402]  48,28.2 180 top
C122  10nF  [0402]  42.4,28.2 180 top
C123  10uF  [0805]  55.3,26.1 180 top
C124  10uF  [0805]  49.8,26.4 180 top
C125  10uF  [0805]  44.2,26.4 180 top
C126  47uF  [1210]  74,61 270 bottom
C127  47uF  [1210]  53.4,21.8 0 top
C128  47uF  [1210]  45.4,21.9 180 top
C129  0.1uF  [0402]  72.07,55.03 270 bottom
C130  0.1uF  [0402]  73.33,53.07 90 bottom
C131  0.1uF  [0402]  68.8,50.9 270 bottom
C132  47uF  [1210]  69.3,54.8 90 bottom
C133  0.1uF  [0402]  70.3,59.3 0 bottom
C134  0.1uF  [0402]  70.3,58 0 bottom
C135  47uF  [1210]  67,59.8 270 bottom
C136  0.1uF  [0402]  63.2,59.2 270 bottom
C137  0.1uF  [0402]  64.4,59.2 270 bottom
C138  10uF  [1206]  40.7,14.1 90 top
C139  10uF  [1206]  58.8,13.7 90 top
C140  10uF  [1206]  39.4,65 0 bottom
C141  10uF  [1206]  60.4,49.85 0 bottom
D1  HSMG-C280  [LED-0402]  20.9,27.2 180 bottom
D2  HSMG-C280  [LED-0402]  22.7,27.2 180 bottom
D3  HSMG-C280  [LED-0402]  24.8,27.1 0 bottom
D4  SESD0402X1UN-0020-090  [0402P-DFN]  6.1,49.7 0 top
D5  SESD0402X1UN-0020-090  [0402P-DFN]  5.9,55.1 0 top
D6  BAR66  [SOT23]  13.5,36.57 180 top
D7  BAR66  [SOT23]  27.3,40.4 90 top
D8  BAR66  [SOT23]  13.5,40.4 90 top
D9  KDZ4.3B  [SOD123]  19.7,37.4 270 top
D10  APFA3011-AK13/F  [RGB_LED_SMD-6]  5.8,52.5 270 bottom
D11  APFA3011-AK13/F  [RGB_LED_SMD-6]  5.8,57.5 270 bottom
F1  C014F-2  [1812]  7.9,46.9 0 top
F2  C014F-2  [1812]  7.9,43.1 0 top
F3  C014F-2  [1812]  7.9,39.3 0 top
J1  SMA002  [MMCX-THRU]  2.1,57.5 90 top
J2  SMA002  [MMCX-THRU]  2.1,52.5 90 top
J3  SMA002  [MMCX-THRU]  2.1,47.5 90 top
J4  SMA002  [MMCX-THRU]  2.1,43 90 top
J5  SMA002  [MMCX-THRU]  2.1,38.5 90 top
J6  ESHF-105-01-L-D-SM-K-TR  [ESHF-105-01-L-D-SM-K-TR]  47,3.8 0 top
J7  12226-8250-00FR  [12226-82X0-00XX]  4.7,22.5 270 top
J8  95278-101A16LF  [JP2X8_SMD]  72.2,13.4 90 bottom
J9  ASP-134488-01  [FMC_HPC_MALE]  67.6,34.5 270 top
L1  1008PS-472  [1008PS]  6.4,52.2 0 top
L2  1008PS-472  [1008PS]  6.3,57.6 0 top
L3  BLM18KG601SN1D  [0603]  49,52.25 270 bottom
L4  BLM18KG601SN1D  [0603]  29.67,64.95 270 bottom
L5  SRNxx-101M  [SRN6045TA]  15.1,52.4 270 top
L6  SRNxx-101M  [SRN6045TA]  17,60.3 270 top
L7  MPZ2012S102AT000  [0805]  22.9,50.7 180 top
L8  MPZ2012S102AT000  [0805]  22.43,64.63 180 top
L9  BLM18KG601SN1D  [0603]  44.7,42.7 180 bottom
L10  BLM18KG601SN1D  [0603]  25.37,55.47 180 bottom
L11  BLM18KG601SN1D  [0603]  54.55,52 270 bottom
L12  BLM18KG601SN1D  [0603]  35.2,64.5 270 bottom
L13  BLM15PX601SN1D  [0402]  34.5,21.7 180 bottom
L14  BLM15PX601SN1D  [0402]  31.6,37.9 45 top
L15  BLM15PX601SN1D  [0402]  32.5,37 45 top
L16  BLM15PX601SN1D  [0402]  57.9,22.4 270 top
L17  BLM15PX601SN1D  [0402]  56.6,22.4 270 top
L18  BLM15PX601SN1D  [0402]  48.6,22.5 270 top
Q1  SI1012R  [SC75]  31.1,41 90 top
Q2  SI1012R  [SC75]  17.4,41 90 top
R1  2k  [0402]  20.9,29.5 90 bottom
R2  4.7k  [0402]  22.7,29.5 90 bottom
R3  4.7k  [0402]  24.8,29.8 90 bottom
R4  3k  [0402]  26.2,43.7 270 top
R5  3k  [0402]  12.3,43.3 270 top
R6  2k  [0402]  9.1,51.1 270 top
R7  2k  [0402]  9,57.2 270 top
R8  150,0.25W  [0603]  27.9,43.7 90 top
R9  150,0.25W  [0603]  18,43.7 90 top
R10  150,0.25W  [0603]  29.8,43.7 90 top
R11  150,0.25W  [0603]  14.2,43.7 90 top
R12  2k  [0402]  10.2,53.7 180 top
R13  2k  [0402]  14.4,64.5 270 top
R14  150,0.25W  [0603]  31.7,43.7 90 top
R15  150,0.25W  [0603]  16.1,43.7 90 top
R16  165k  [0402]  33.4,40.7 270 top
R17  165k  [0402]  19.6,40.9 270 top
R18  10k  [0402]  37.3,40.7 90 top
R19  10k  [0402]  23.5,40.9 90 top
R20  1k  [0402]  34.7,40.7 270 top
R21  1k  [0402]  20.9,40.9 270 top
R22  10k  [0402]  49.1,51.3 90 top
R23  3k  [0402]  49.1,53.5 90 top
R24  5.6k 1%  [0402]  29.39,64.16 90 top
R25  21k 1%  [0402]  29.39,66.45 90 top
R26  60 1%  [0402]  4.5,19.1 0 bottom
R27  60 1%  [0402]  5,20.4 0 bottom
R28  49.9  [0402]  33.4,43.7 270 top
R29  49.9  [0402]  19.7,43.7 270 top
R30  100  [0402]  31,4.4 270 bottom
R31  100  [0402]  31,1.9 90 bottom
R32  100  [0402]  36.8,1.5 90 bottom
R33  3k  [0402]  2.6,20.1 90 bottom
R34  49.9  [0402]  44.8,44.1 180 top
R35  49.9  [0402]  24.9,56.5 270 top
R36  4.7k  [0402]  50.3,39.3 270 top
R37  4.7k  [0402]  30,52 270 top
R38  4.7k  [0402]  48.9,39.3 270 top
R39  4.7k  [0402]  28.7,52 270 top
R40  10k  [0402]  50.4,51.3 90 top
R41  0  [0402]  50.4,53.5 90 top
R42  10k  [0402]  30.74,64.16 90 top
R43  0  [0402]  30.74,66.45 90 top
R44  3k  [0402]  21.3,38.2 90 top
R45  3k  [0402]  22.6,38.2 90 top
R46  4.7k  [0402]  58.7,47.4 270 bottom
R47  1k  [0402]  7.2,50.3 180 bottom
R48  1k  [0402]  7.2,55.4 180 bottom
R49  4.7k  [0402]  39.6,60.5 0 bottom
R50  1k  [0402]  7.2,51.6 180 bottom
R51  1k  [0402]  7.2,56.7 180 bottom
R52  1k  [0402]  7.2,52.9 180 bottom
R53  1k  [0402]  7.2,58 180 bottom
R54  0  [0402]  32.2,26.9 180 bottom
R55  165k  [0402]  9.6,50.3 0 bottom
R56  165k  [0402]  9.6,54.1 0 bottom
R57  165k  [0402]  9.6,51.6 0 bottom
R58  165k  [0402]  9.6,56.7 0 bottom
R59  2.2k  [RN2X8-1506]  19.9,10.5 90 top
R60  2.2k  [RN2X8-1506]  19.9,15.6 90 top
R61  2.2k  [RN2X8-1506]  19.9,26.9 90 top
R62  2.2k  [RN2X8-1506]  19.9,21.9 90 top
R63  2k  [0402]  38.3,43.8 270 bottom
R64  2k  [0402]  39.7,43.8 270 bottom
R65  10k  [0402]  30.7,14.3 0 bottom
R66  3.48k  [0402]  50.63,66.92 90 top
R67  3.48k  [0402]  53.38,66.92 90 top
R68  649k  [0402]  54.75,66.92 90 top
R69  0  [0402]  35.2,16.9 0 bottom
R70  10k  [0402]  35.2,13 0 bottom
R71  10k  [0402]  39.1,13.7 90 bottom
R72  10k  [0402]  35.2,15.6 180 bottom
R73  10k  [0402]  58.4,56.8 270 top
R74  10k  [0402]  58.4,60.2 90 top
R75  15k  [0402]  56.1,33.5 0 top
R76  4.7k  [0402]  53.8,33.5 0 top
R77  43k  [0402]  50.6,33.8 0 top
R78  4.7k  [0402]  48.3,33.8 0 top
R79  43k  [0402]  45,33.8 0 top
R80  4.7k  [0402]  42.7,33.8 0 top
R81  2k  [0402]  70.2,50.9 90 bottom
R82  2k  [0402]  71.6,50.9 90 bottom
R83  165k  [0402]  54.3,19.4 180 top
R84  178k  [0402]  46.5,19.4 180 top
R85  10k  [0402]  74.5,44.8 90 bottom
R86  10k  [0402]  68.9,44.8 90 bottom
R87  73.2k  [0402]  50.7,11.6 0 bottom
R88  73.2k  [0402]  48.4,11.6 180 bottom
S1  CHS-01TA  [DIP01-SMD-GULL]  42.3,37.35 270 bottom
S2  CHS-01TA  [DIP01-SMD-GULL]  23.2,49.2 270 bottom
S3  CHS-02TB  [CHS-02TB]  71.7,40.1 0 bottom
SJ1  [SJ_2_0201]  9.6,17 90 bottom
SJ2  [SJ_2_0201]  8.8,15.8 270 bottom
TP1  [B1,27]  20.9,31.5 270 bottom
TP2  [B1,27]  22.7,31.5 270 bottom
TP3  [B2,54]  25.6,19 0 bottom
TP4  [B1,27]  24.9,31.7 270 bottom
TP5  [B1,27]  14.7,40.6 0 bottom
TP6  [B1,27]  21.1,44.6 0 bottom
TP7  [B1,27]  34.1,44.7 0 bottom
TP8  [B2,54]  3.5,33.8 0 bottom
TP9  [B2,54]  72.3,66.4 0 bottom
TP10  [B2,54]  24,67.2 0 bottom
TP11  [B1,27]  69.3,66.1 270 bottom
TP12  [B1,27]  70.1,62.6 0 bottom
TP13  [B1,27]  48.8,65.4 0 bottom
TP14  [B1,27]  48,58.6 0 bottom
TP15  [B1,27]  19,32 0 bottom
TP16  [B1,27]  60.5,57.8 0 bottom
TP17  [B2,54]  5.1,6.8 0 bottom
TP18  [B2,54]  39.2,27.9 0 bottom
U1  NC7WZ07P6X  [SC70]  17.3,37.9 180 top
U2  SN65LVDS9638DGN  [MSOP-8-PAD-3X3]  36,8.2 180 top
U3  FIN1032MTCX  [TSSOP-16]  34.1,3.1 0 top
U4  LTC2875_DFN  [DFN83X3]  4.3,22.9 270 bottom
U5  ADCMP600  [SOT-23-5]  36.2,43.7 270 top
U6  ADCMP600  [SOT-23-5]  22.5,43.7 270 top
U7  DG1412E  [QFN16-4X4MM]  16.3,28.9 0 top
U8  DG1412E  [QFN16-4X4MM]  16.3,22 0 top
U9  DG1412E  [QFN16-4X4MM]  16.2,15.2 0 top
U10  DS90UB934-Q1  [WQFN48-7X7-PAD]  52.4,44.55 180 top
U11  DS90UB934-Q1  [WQFN48-7X7-PAD]  33,57.3 180 top
U12  DS91M040  [WQFN32-5X5]  47.1,3.9 180 bottom
U13  AD5766BCPZ-RL7  [CP_40_7]  30,33 135 top
U14  MCP47FEB02A0-E/ST  [TSSOP-8]  39.6,42.4 0 top
U15  LM4132AMF-2.5/NOPBCT-ND  [SOT-23-5]  27.4,15.3 90 bottom
U16  AD7617BSTZ  [ST_80_2]  30.5,18.7 0 top
U17  AD5142BCPZ10  [CP_16_27-L]  59.7,66 270 top
U18  LTM4622A  [BGA_5X5_625X625]  51.7,61.67 0 top
U19  TPS7A49  [PVSON-N8+4-3X3]  54.4,30.6 270 top
U20  TPS7A49  [PVSON-N8+4-3X3]  48.9,30.9 270 top
U21  TPS7A30  [PVSON-N8+4-3X3]  43.3,30.9 270 top
U22  24AA64ST  [TSSOP8]  71.6,48.1 270 bottom
U23  LTM8049_BGA  [LTM8049]  49.7,14.2 270 top
X2  OE-LOGO_7X5  [OE-LOGO-7X5]  71.8,2.7 0 top
X3  OE-LOGO_7X5  [OE-LOGO-7X5]  71.8,2.7 0 bottom
X4  FMC_SINGLE_WIDTH_MODULE  [FMC_SINGLE_WIDTH_MODULE]  65.6,3 0 top

## Tracks (layer width: path | path; a pad name or v marks a point on that pad's centre or on a via)
!ADC_CS  (via drill 0.2)
  Top/HighSpeed 0.2: U16.63 35.4,26.35 v35.4,27.5 | v63.6,25.4 64,25.4 J9.H13
  Highspeed2 0.2: v35.4,27.5 37.5,27.5 39.7,25.3 63.2,25.3 63.3,25.4 v63.6,25.4
!ADC_RESET  (via drill 0.2)
  Top/HighSpeed 0.09: v66.5,20.7 J9.F10
  Highspeed2 0.09: v66.5,20.7 65.9,20.1 42.3,20.1 41.2,19 41.2,16.8 40.2,15.8 37.6,15.8 v36.7,14.9
  Bottom/LowSpeed 0.09: v36.7,14.9 36.43,14.9 R72.2
!DAC_CS  (via drill 0.2)
  Top/HighSpeed 0.2: v36.68,31.1 33.67,31.1 U13.8 | J9.J16 63.15,28.75 v62.7,28.3
  Highspeed2 0.2: v36.68,31.1 38.1,31.1 41.7,27.5 61.9,27.5 v62.7,28.3
!DAC_RESET  (via drill 0.2)
  Top/HighSpeed 0.09: U13.3 v31.61,29.62 v31.62,29.62 | v66.5,25.8 66.52,25.8 J9.F14
  Highspeed2 0.09: v31.62,29.62 32.24,29 37,29 40.2,25.8 v66.5,25.8
!LINK_PWR_ADJ_CS  (via drill 0.2)
  Top/HighSpeed 0.089: 61.48,65.75 61.85,65.75 v62.4,65.2
  Top/HighSpeed 0.09: U17.14 61.48,65.75 | v66.4,57 66.67,56.73 J9.F38
  Highspeed2 0.09: v62.4,65.2 62.4,65.12 65.76,61.76 65.76,57.64 v66.4,57
!LINK_PWR_ADJ_RESET  (via drill 0.2)
  Top/HighSpeed 0.09: v67.6,56 68.14,55.45 J9.E37 | U17.16 v62.53,66.75
  Highspeed2 0.09: v62.53,66.75 62.79,66.49 62.79,65.51 66.9,61.4 66.9,56.7 v67.6,56
$N1
  Top/HighSpeed 0.18: R5.2 10,42.77 F2.2 | 12.43,42.9 R5.2 | R29.1 19.47,44.56 R9.2 16.4,44.56 R15.2 R11.2 14.1,44.56 R5.2 | R5.2 12.3,40.4
  Top/HighSpeed 0.4: F2.2 10.15,44.05 10.1,44 10.1,43.3 10.53,42.87 | 12.3,40.4 D8.3
$N2
  Top/HighSpeed 0.18: 16.7,36.2 16.7,36.95 U1.4 | U1.6 17.95,36.35 17.8,36.2 16.7,36.2 | 16.7,36.2 15.97,35.48 D6.3 13.47,35.5 12.4,35.5 11.47,36.58 11.47,38.12 10,39.6 | 10,39.6 10,39.9 10.1,40 10.1,39.4 F3.2 10,39.6 | 10,39.6
  Top/HighSpeed 0.4: 10,39.4 F3.2
$N3
  Top/HighSpeed 0.18: F1.2 10.5,46.9 11.55,45.85 24.2,45.85 25.2,44.85 25.2,43.6 25.63,43.17 R4.2 | 31.9,44.56 33.17,44.56 R28.1 arc90 33.07,44.56 R14.2 R10.2 R8.2 27.12,43.78 27.12,43.62 26.67,43.17 R4.2 | R4.2 26.07,43.04 | R4.2 D7.3 | D7.3
  Top/HighSpeed 0.4: D7.3 25.7,40.4 25.8,40.5 | 26.3,43.22 R4.2 26.18,43.2 | 10,48.2 | 10,48.2 F1.2
+1V8  (via drill 0.2, 0.4)
  Top/HighSpeed 0.09: v30.68,62.88 30.68,63.57 | 49.1,50.57 R22.1 49.1,50 v49.07,49.97 | R24.1 29.25,63.49 v29.25,62.95 | R40.1 50.4,50.07 v50.28,49.95
  Top/HighSpeed 0.11: 30.68,63.57 R42.1
  Top/HighSpeed 0.2: 37,56.55 U11.17 | 56.35,43.8 U10.17
  Top/HighSpeed 0.4: J9.E39 68.29,57.99 v67.5,57.3 | J9.F40 66.83,59.27 v66.3,59.8 | J9.G39 v65.2,58.6 J9.H40 | v38,56.4 37.85,56.55 37,56.55 | v57.4,43.75 57.35,43.8 56.35,43.8
  Bottom/LowSpeed 0.09: TP16.TP 61.06,58.35 | C137.2 65.13,58.67 v65.2,58.6
  Bottom/LowSpeed 0.4: 67.5,58.4 v67.5,57.3 | 67.5,58.4 67.5,58.6 | 66.3,58.5 v66.3,59.8 | 66.3,58.5 66.3,58.35 | v65.2,58.6 66.3,58.5 | C135.2 67.5,58.4 | C136.2 C137.2 | C92.2 38.65,54.35 38.65,55.5
  Bottom/LowSpeed 1: 38.65,55.5 v38.7,55.6
  Bottom/LowSpeed 1.5: C135.2 66.95,58.35 66.3,58.35 61.06,58.35 59.3,56.59 45.48,56.59 43.07,54.18 | 43.07,54.18 45.8,51.45 45.8,49.7 | 38.65,55.5 38.65,52.2 39.3,51.55 40.44,51.55 43.07,54.18
  other vias: 23,55.3 23.7,55.3 23.7,56 29.77,62.97 37.65,55.6 23,56 42.35,42.55 42.85,42.55 42.9,43.35 42.35,43.35 38.5,56.45 49.55,50 57.85,43.7 58.5,43.65 39.2,55.6 39.15,56.45 48.55,50 45.85,49.05 46.45,49 46.02,49.81 46.45,49.55 46.45,50.05 38.15,55.6 45.25,49.05 45.68,49.42
  pour Bottom/LowSpeed (no thermals): 31,62.6 28.9,62.6 28.87,64.62 30.47,64.62 31,64.09
  pour Bottom/LowSpeed (no thermals): 37.1,56.7 37.1,54.9 39.5,54.9 39.5,56.7
  pour Bottom/LowSpeed (no thermals): 24.9,54.7 24.9,56.4 22.7,56.4 22.7,54.7
  pour VCC: 22.7,54.7 38.8,54.7 39.5,55.4 39.5,56.7 36.1,56.7 36.1,60.5 31.3,60.5 31.3,63.2 28.9,63.2 28.9,56.4 22.7,56.4
  pour Bottom/LowSpeed (no thermals): 44.3,42.05 44.3,43.75 42.1,43.75 42.1,42.05
  pour VCC: 42.1,41.95 58.2,41.95 58.9,42.65 58.9,43.95 55.5,43.95 55.5,47.75 50.7,47.75 50.7,50.65 45.05,50.65 45.05,48.75 48.3,48.75 48.3,43.65 42.1,43.65
  pour Bottom/LowSpeed (no thermals): 50.35,49.75 48.25,49.75 48.22,51.87 49.82,51.87 50.35,51.34
  pour Bottom/LowSpeed (rank 2, no thermals): 45.05,48.75 46.75,48.75 46.75,50.25 45.05,50.25
  pour Bottom/LowSpeed (no thermals): 56.5,43.95 56.5,42.15 58.8,42.15 58.8,43.95
+3V3  (via drill 0.2, 0.3, 0.4, 0.7)
  Top/HighSpeed 0.089: U17.15 61.89,66.25 v61.99,66.15 | U17.10 58.97,64.6 58.95,64.58
  Top/HighSpeed 0.09: U3.4 32.37,3.42 v32.4,3.4 | 26.34,51.44 v26.3,51.4 26.35,51.45 28.68,51.45 R39.2 R37.2 30.17,51.47 30.9,52.2 31.2,52.2 31.75,52.75 U11.4 U11.5 | 50.3,38.7 R36.2 49.63,38.77 v49.6,38.8 49.57,38.77 R38.2 | 50.3,38.7 50.3,38.5 | U10.4 U10.5 51.65,40.05 50.3,38.7
  Top/HighSpeed 0.3: v32.8,29.6 32.34,29.6 U13.4 | U1.5 17.3,37.7 17.4,37.8 v18.2,37.8 | U3.16 36.87,5.4 v35.9,5.4 | U17.9 58.95,64.58 58.95,64.25 v58.55,63.85 | U2.1 39.07,7.22 v39.2,7.1
  Top/HighSpeed 0.4: U16.49 38.12,17.7 v36.8,17.7 | U23.L7 U23.K7 | U23.A7 U23.B7 | U14.1 38.63,40.37 v38.2,40.8 | U14.2 39.28,40.18 v39.8,40.7 | 69.5,56.7 J9.D38 | J9.D38 69.5,56.7 | v70.1,54.8 70.1,54.78 J9.D36 v68.9,54.8 | v71.49,57.25 70.77,57.92 J9.C39 70.18,57.4 v70.1,57.4 70.1,57.32 J9.D38 | U5.5 36.55,44.65 v36.2,45 | v22.9,45 23.5,45 U6.5 | J9.D40 v69,58.7
  Bottom/LowSpeed 0.089: 23.11,49.23 S2.2
  Bottom/LowSpeed 0.09: R86.2 v68.9,45.9 | R85.2 v74.5,45.9 | R63.2 R64.2 40.13,43.27 v40.4,43 | R70.1 v36.3,13 | R69.1 35.73,17.47 v35.7,17.5 | C29.1 39.67,7.1 | v38.05,60.8 38.35,60.5 R49.2 | R46.2 59.98,46.87 60,46.85 | v41.35,38.62 42.3,37.67 S1.2 | v22,49.6 22.37,49.23 23.11,49.23
  Bottom/LowSpeed 0.11: TP11.TP v69.3,67
  Bottom/LowSpeed 0.2: U4.3 4.55,25.12 C39.1 v5.6,25.4 | U12.12 44.7,3.4 U12.11 | U12.30 U12.29 | 50.82,3.65 C82.2 | R71.1 39.1,12.7 v39.3,12.5
  Bottom/LowSpeed 0.3: 35.43,5.4 v35.9,5.4 | 39.67,7.1 v39.2,7.1 | C33.1 C29.1 | C34.1 C30.1 | 44.7,3.4 C78.2 43.83,3.99 v43.76,4.06 | U12.29 50.82,3.65 | C82.2 51.56,3.73 v51.6,3.7 | v18.2,37.8 17.83,37.8 C11.2 | 61.33,66.16 C110.2 61.97,66.13 v61.99,66.15 | v58.55,63.85 59.54,63.85 59.62,63.77
  Bottom/LowSpeed 0.4: 37.1,18 v36.8,17.7 | 37.1,18 C113.2 | C116.2 37.1,16.36 37.1,18 | C93.2 32.65,29.6 v32.8,29.6 33.26,30.06 C96.2 | v59.3,63 59.3,63.46 59.62,63.77 C112.2 | v68.9,54.8 68.9,55.8 C132.2 69.3,56.6 v70.1,57.4 69.77,57.83 C134.2 C133.2 v69,58.7 | v70.1,54.8 70.1,56.4 | C23.1 v36.2,45 | C89.2 38.2,41.53 v38.2,40.8 | v39.8,40.7 40.14,40.36 C74.2 | v22.9,45 22.9,44.13 C24.1 | C30.1 35.33,5.3 35.43,5.4 | v43.76,4.06 43.76,3.53 C78.2
  Bottom/LowSpeed 0.7: L11.1 55.86,51.55 59.25,51.55 60,50.8 60,46.85 60,39.9 58.56,38.46 v57.55,38.46
  other vias: 35.65,64.55 35.15,64.55 34.65,64.55 40.5,11.2 42.4,12.2 42.5,11.1 41.6,11.2 56.9,11.7 59.2,10.5 58.1,10.5 56.9,10.5 42.4,13 56.9,12.8
  pour VCC (isolate 0.1, rank 3, no thermals): -9.4,73 -9.4,-8 94.6,-8 94.6,73
  pour Top/HighSpeed (no thermals): 44,13.6 44,10 40.9,10 40,10.9 40,13.2 41.8,13.2 42.2,13.6
  pour Top/HighSpeed (no thermals): 55.4,13.6 55.4,9.7 59.4,9.7 60,10.3 60,13.1 57.7,13.1 57.2,13.6
  pour Bottom/LowSpeed (no thermals): 34.35,64.2 34.4,65.95 36,65.95 35.95,64.2
  pour Bottom/LowSpeed (no thermals): 53.75,51.8 53.75,53.4 55.35,53.4 55.35,51.8
+5V_AN  (via drill 0.2, 0.35, 0.4, 0.7)
  Top/HighSpeed 0.2: C106.2 26.25,34.98 U13.28
  Top/HighSpeed 0.4: U16.6 23.87,21.62 24.2,21.3 v24.2,21.2 | v29.7,12.32 29.8,12.22 29.87,12.22 30.17,11.91 U16.30 | U16.15 23.77,15.78 v24.2,16.2 | U16.71 30.17,25.38 v29.7,24.9 | C106.2 25.65,35.4 v25.5,35.4
  VCC 0.2: v21.9,29.5 22,29.4 23.5,29.4
  Bottom/LowSpeed 0.09: U15.3 26,16.3 v25.3,16.3
  Bottom/LowSpeed 0.2: 25.14,34.14 C107.2 25.47,33.95 25.4,33.95 | 20.9,31.6 TP1.TP R1.2 21.43,29.5 v21.9,29.5
  Bottom/LowSpeed 0.4: 29.7,25.3 v29.7,24.9 | C83.2 29.7,25.3 | C77.2 29.66,25.26 29.7,25.3 | 24.1,16.3 C90.2 | 24.1,16.3 v24.2,16.2 | C61.2 24.1,14.86 24.1,16.3 | C64.2 28.58,12.32 v29.7,12.32 30.1,11.92 C85.2 | C71.2 24.2,22.34 v24.2,21.2 23.8,20.8 C84.2 | v25.5,35.4 25.5,34.05 25.4,33.95 | U15.4 30.4,16.25 C81.1 29.9,16.75 v29.9,16.9
  Bottom/LowSpeed 0.7: L13.1 v31.7,21.7
  pour VCC (isolate 0.1, no thermals): 23,11.5 23,33.9 24.9,35.8 27.6,35.8 27.6,27.5 30.6,27.5 30.6,23 32.6,23 32.6,20.5 30.3,20.5 30.3,11.5
+12V  (via drill 0.2, 0.3, 0.4, 0.7)
  Top/HighSpeed 0.4: 22,38.73 R45.2 R44.2 21.1,38.93 v21.1,39.1 | 8.9,30.44 J7.26 | J9.C37 70.84,55.45 v71.3,55 71.3,54.52 71.38,54.44 71.38,53.93 71.3,53.85 v71.3,53.5 70.77,52.98 J9.C35 | J7.1 9.64,14.56 8.1,16.1
  Top/HighSpeed 0.7: 8.1,16.1 8.1,29.64 8.9,30.44
  Top/HighSpeed 1: 50.95,58.25 47.62,54.92 47.62,53.42 v43.8,49.6
  Highspeed2 0.4: 15.2,43.4 19.5,39.1 v21.1,39.1
  Highspeed2 1: v12.2,31.3 12.2,40.4 15.2,43.4 17.71,45.91 23.28,45.91 23.28,45.9 25.82,45.9 25.82,45.91 26.58,45.91 26.58,45.9 35.82,45.9 35.82,45.91 40.11,45.91 v43.8,49.6
  Bottom/LowSpeed 0.09: TP12.TP 69.3,62.6 69.3,63.3
  Bottom/LowSpeed 0.4: C130.2 C129.2
  Bottom/LowSpeed 0.406: v51.08,59.8 v51.08,63.55
  Bottom/LowSpeed 1: 63.88,63.3 67.58,63.3
  Bottom/LowSpeed 1.5: 67.58,63.3 69.3,63.3 73,59.6 C126.2 | v51.6,58.3 52.04,58.74 56.93,58.74 59.65,61.46 62.04,61.46 63.88,63.3
  other vias: 50.6,58.5 50.6,58 51.2,58 51.1,58.5 51,59.2 51.7,59.78 50.4,59.7 51.9,58
  pour Top/HighSpeed (rank 2, no thermals): 50.2,62.67 51.95,62.67 51.95,63.17 50.45,64.67 50.2,64.67
  pour Top/HighSpeed (no thermals): 50.2,60.7 50.2,57.8 52.9,55.1 54.7,55.1 54.7,58.8 52.5,58.8 52.5,60.7
  pour Top/HighSpeed (no thermals): 13.4,30.3 8.6,30.3 8.6,31.6 13.4,31.6
  pour Bottom/LowSpeed (no thermals): 71.1,55.2 72.9,55.2 72.9,60.3 74.1,60.3 74.1,53.2 71.1,53.2
+13V_AN  (via drill 0.2, 0.4)
  Top/HighSpeed 0.2: U13.26 27.02,35.62 C104.2 | v18.62,29.09 18.48,29.23 U7.11 | U8.11 18,22.32 v17.88,22.44 | U9.11 v18.12,15.34
  Top/HighSpeed 0.4: C104.2 26.5,36.25 v26.5,36.4 26.5,37.1 27.4,38 27.73,38 27.75,38.01 30.3,38.01 30.79,37.52 L14.1
  VCC 0.2: 19.6,28.2 19.36,28.2 18.62,28.94 v18.62,29.09 | v21.58,30.05 21.5,30.05 21.45,30.1 | v17.88,22.44 17.34,22.44 17.3,22.4 | v18.12,15.34 17.46,15.34 17.3,15.5
  VCC 0.4: 19.6,28.2 21.45,30.05 21.45,30.1 21.45,32.25 25.6,36.4 v26.5,36.4 | 18.35,26.95 18.29,26.89 18.29,24.67 17.3,23.69 17.3,22.4 17.3,15.5
  VCC 0.406: 19.6,28.2 18.35,26.95
  Bottom/LowSpeed 0.2: 22.7,31.64 TP2.TP R2.2 21.6,30.03 v21.58,30.05 | C105.2 26.9,35.9 26.9,36.1 | C10.2 17.17,15.2 18.12,15.2 v18.12,15.34 | v18.62,29.09 18.77,28.93 C8.2 | C9.2 17.47,22.03 v17.88,22.44
  Bottom/LowSpeed 0.4: 27.16,35.84 26.9,36.1 v26.5,36.4
+15V
  Top/HighSpeed 1: C127.2 54.63,21.96
  pour Top/HighSpeed (no thermals): 58.2,16.3 54.3,16.3 54.3,23.2 55.8,23.2 55.8,22.2 58.2,22.2
-13V_AN  (via drill 0.2, 0.4)
  Top/HighSpeed 0.15: v16.14,15.2 U9.PAD | U13.PAD v28.95,33
  Top/HighSpeed 0.2: 15.65,29.45 16.2,28.9 | 15.65,29.45 v15.6,29.5 | v13.8,29.1 13.92,29.23 U7.2 | U7.PAD 15.75,29.45 15.65,29.45 | U9.2 14.11,15.53 v13.94,15.7
  Top/HighSpeed 0.203: v13.9,22.31 U8.2
  Top/HighSpeed 0.3: U13.6 31.4,31.95 31.4,32 31.3,32
  Top/HighSpeed 0.4: 31.4,32 v31.95,32.2 | v32.6,35.8 32.6,36.15 L15.1
  VCC 0.2: 14.69,22.01 arc-90 14.7,22 | v16.14,15.2 15.1,15.2 | v13.8,29.1 14.2,29.1 15,28.3 15.1,28.3 | v15.6,29.5 15.9,29.2 16,29.2 | v13.94,15.7 14.6,15.7 14.7,15.6
  VCC 0.203: v13.9,22.31 14.61,22.31 14.7,22.4 | 14.7,22 U8.PAD
  VCC 0.4: v32.6,35.8 30.39,38.01 26.46,38.01 20.7,32.25 19.76,32.25 18.61,31.1 18.19,31.1 17.9,31.1 16,29.2 15.1,28.3 14.9,28.1 14.9,26.61 14.9,26.5 14.7,26.3 14.7,22.4 14.7,22 14.7,15.6 15.1,15.2
  Bottom/LowSpeed 0.19: 31,34.2 30.1,34.2 v30,34.1
  Bottom/LowSpeed 0.2: v13.94,15.7 14.73,15.2 C20.2 | R3.2 24.8,31.6 TP4.TP 25.11,31.69 25.3,31.5 27.4,31.5 28,32.1 v28.05,32.1 | C18.2 13.03,29.1 v13.8,29.1 15.2,29.1 v15.6,29.5
  Bottom/LowSpeed 0.203: C19.2 14.18,22.03 v13.9,22.31
  Bottom/LowSpeed 0.4: v32.6,35.8 31,34.2
  other vias: 31.1,33 31.9,33.8 30.85,31.1 29.1,31 30,31.9 16.3,22 30.75,34.85
  pour Bottom/LowSpeed (no thermals): 27.7,32.2 30.8,35.3 33.1,33 30,29.9
-15V
  pour Top/HighSpeed (no thermals): 49.1,16.1 49.1,22.2 46.5,22.2 46.5,17.4 45.2,17.4 45.2,16.1
ADC_BUSY  (via drill 0.2)
  Top/HighSpeed 0.2: v62.6,24 62.86,24 J9.J12 | v33.2,24.9 32.77,25.32 U16.67
  Highspeed2 0.2: v33.2,24.9 34.6,23.5 62.1,23.5 v62.6,24
ADC_CONVST  (via drill 0.2)
  Top/HighSpeed 0.2: U16.68 32.12,25.48 v32.3,25.3 | J9.K13 61.61,24.7 v60.9,24.7
  Highspeed2 0.2: v32.3,25.3 33.2,26.2 37.7,26.2 39.2,24.7 v60.9,24.7
ADC_MISO_A  (via drill 0.2)
  Top/HighSpeed 0.2: U16.57 38.15,22.9 v39.3,22.9 | J9.K11 61.56,22.43 v61.3,22.7
  Highspeed2 0.2: v61.3,22.7 61.1,22.9 v39.3,22.9
ADC_MISO_B  (via drill 0.2)
  Top/HighSpeed 0.2: U16.56 38.15,22.3 v39.3,22.3 | J9.J10 63.15,21.25 v62.8,21.6
  Highspeed2 0.2: v39.3,22.3 61.13,22.3 62.1,22.3 v62.8,21.6
ADC_MOSI  (via drill 0.2)
  Top/HighSpeed 0.2: U16.55 38.15,21.6 v39.3,21.6 | J9.K10 61.5,21.55 v61.5,21.6
  Highspeed2 0.2: v39.3,21.6 v61.5,21.6
ADC_SCLK  (via drill 0.2)
  Top/HighSpeed 0.2: U16.62 36,26.3 v36,25.2 | J9.J13 62.88,24.7 v62.6,24.7
  Highspeed2 0.2: v36,25.2 36,25.13 37.03,24.1 61.7,24.1 62.3,24.7 v62.6,24.7
ADDR0  (via drill 0.2)
  Top/HighSpeed 0.09: 70.85,42.76 J9.C27 71.25,42.76 v71.4,42.9
  Bottom/LowSpeed 0.09: R85.1 72.69,44.27 S3.4 72.33,43.84 v71.4,42.9
ADDR1  (via drill 0.2)
  Top/HighSpeed 0.09: v70.3,42 70.77,41.52 J9.C26
  Bottom/LowSpeed 0.09: v70.3,42 70.3,43.91 | 70.3,43.91 S3.3 | 70.3,43.91 69.26,43.91 R86.1
AGND  (via drill 0.2, 0.35, 0.4, 0.7)
  Top/HighSpeed 0.09: R60.C1 v19.9,13
  Top/HighSpeed 0.15: 27.69,36.4 C104.1 | v13.8,28.4 13.92,28.52 13.96,28.52 14.01,28.57 U7.3
  Top/HighSpeed 0.2: v27.2,37 27.72,36.48 C104.1 | U13.29 26.36,34.16 25.38,34.16 C106.1 | U13.25 27.69,35.66 | 14.13,14.88 U9.3
  Top/HighSpeed 0.3: U13.31 26.28,32.52 v25.8,33 | U13.20 30.48,36.82 v30.1,37.2 | U13.10 34,32.86 v34,33 | J7.14
  Top/HighSpeed 0.4: v21.53,21.8 21.53,22.03 21.77,22.27 U16.5 | U16.29 29.52,9.97 v29.7,9.7 | U16.16 21.87,15.12 21.5,15.5 v21.5,15.8 | U16.72 29.52,27.8 v29.5,27.8 | U16.34 32.8,11.07 32.8,10.2 v31.63,9.07 | U16.69 31.47,24.73 v31.6,24.6 | C106.1 25.05,34.5 v24.6,34.5 | U16.32 31.47,10.07 31,9.6 v30.6,9.6
  Bottom/LowSpeed 0.09: v25.6,20.6 TP3.TP
  Bottom/LowSpeed 0.15: C19.1 14.46,21.51 v14.12,21.51
  Bottom/LowSpeed 0.2: D2.C D1.C 20.9,25.8 20.5,25.4 v19.9,25.4 | v13.8,28.4 13.47,28.07 C18.1 | v18,20.36 17.8,20.56 C9.1 | C10.1 17,13.6 v17.8,12.8 | C8.1 19.09,27.65 19.07,27.49 19.07,26.3 v18.89,26.12 | v25.6,25 25.6,25.57 D3.A | C20.1 14.9,13.85 v14.1,13.05
  Bottom/LowSpeed 0.3: 26.6,32.66 26.14,32.66 v25.8,33 | 30.14,36.4 30.14,37.16 v30.1,37.2 | C99.1 33.95,33 v34,33
  Bottom/LowSpeed 0.4: C83.1 29.5,27.03 29.5,27.3 | v29.5,27.8 29.5,27.3 | 29.5,27.3 28.14,27.3 C77.1 | C101.1 31.54,24.54 v31.6,24.6 | C84.1 22.33,20.8 v21.53,21.8 21.53,22.47 C71.1 | C90.1 22,16.3 v21.5,15.8 21.5,14.86 C61.1 | C85.1 30.1,10 30.04,10.06 29.9,10.06 | 29.9,10.06 C64.1 | v29.7,9.7 29.8,9.96 29.9,10.06 | 31.56,9.96 31.56,10.06 C95.1 31.16,10.06 v30.6,9.6 | C81.2 30.7,18.35 v30.75,18.3 | v28.2,28.6 C103.1 | C100.1 v32.6,16.3 | v25.2,15.3 U15.2
  Bottom/LowSpeed 0.7: R54.1 31.67,27.31 v31.2,27.77
  Bottom/LowSpeed 1: 30.14,36.4 C88.1 C105.1 C107.1 26.6,32.66
  other vias: 19.85,11.6 19.85,10.15 19.9,8.45 29.9,21.25 25.05,13.15 13.9,30.8 22,34.4 25.9,38.2 19.1,34.4 23.8,36.1 30.8,8.6 32.7,19.3 17.5,9.35 15.2,11.65 10,22.25 10,23.7 10,26.5 10,28.2 10,29.8 19.9,18.7 19.9,23.8 18.7,17.9 14.4,31.3 15.1,32 16.9,33.8 35.5,34 34.3,35.1 34.9,33.4 14.05,18.1 14.18,20.15 17.75,26.5
  pour Top/HighSpeed (isolate 0.1, rank 2): 9.7,21.9 13.3,21.9 13.6,21.6 13.6,15.4 10.4,15.4 10.4,15 13.6,15 13.6,13 18.4,8.2 31.5,8.2 33.3,10 33.3,24 32,25.3 32,27.8 30.1,29.7 33.3,32.9 34,32.2 35.7,34 31.29,38.41 25.82,38.39 22,34.5 17.4,34.5 13.7,30.8 13.7,30.1 9.7,30.1
  pour GND3 (isolate 0.1, no thermals): 9.7,21.9 13.3,21.9 13.6,21.6 13.6,13 18.4,8.2 31.5,8.2 33.3,10 33.3,24 32,25.3 32,27.8 30.1,29.7 33.3,32.9 34,32.2 35.7,34 31.29,38.41 25.82,38.39 22,34.5 17.4,34.5 13.7,30.8 13.7,30.1 9.7,30.1
  pour VCC (isolate 0.1, rank 2, no thermals): 9.7,21.9 13.3,21.9 13.6,21.6 13.6,13 18.4,8.2 31.5,8.2 33.3,10 33.3,24 32,25.3 32,27.8 30.1,29.7 33.3,32.9 34,32.2 35.7,34 31.29,38.41 25.82,38.39 22,34.5 17.4,34.5 13.7,30.8 13.7,30.1 9.7,30.1
  cutout GND1 (isolate 0.1, rank 2, no thermals): 9.7,21.9 13.3,21.9 13.6,21.6 13.6,13 18.4,8.2 31.5,8.2 33.3,10 33.3,24 32,25.3 32,27.8 30.1,29.7 33.3,32.9 34,32.2 35.7,34 31.29,38.41 25.82,38.39 22,34.5 17.4,34.5 13.7,30.8 13.7,30.1 9.7,30.1
AIN_AOUT0  (via drill 0.2)
  Top/HighSpeed 0.09: v63.9,32.9 64.2,32.59 J9.H19 | U7.15 15.9,30.75 v15.9,30.45
  Bottom/LowSpeed 0.09: v63.9,32.9 63.5,33.3 39.3,33.3 32.65,39.95 24.85,39.95 20.6,35.7 16.5,35.7 13.9,33.1 13.9,32.45 v15.9,30.45
AIN_AOUT1  (via drill 0.2)
  Top/HighSpeed 0.09: v65.2,33 65.6,32.59 J9.G19 | v16.08,26.42 15.97,26.52 U7.6
  Bottom/LowSpeed 0.09: v65.2,33 64.6,33.6 39.5,33.6 32.85,40.25 24.75,40.25 20.5,36 15,36 9.3,30.3 9.3,26.5 9.78,26.02 15.68,26.02 v16.08,26.42
AIN_AOUT2  (via drill 0.2)
  Top/HighSpeed 0.09: v62.6,31.6 62.87,31.32 J9.J18 | v16.6,31.5 16.62,31.48 U7.14
  Bottom/LowSpeed 0.09: v62.6,31.6 62.1,32.1 59.5,32.1 59,32.6 39,32.6 32.25,39.35 25.05,39.35 20.9,35.2 16.8,35.2 15.15,33.55 15.15,32.95 v16.6,31.5
AIN_AOUT3  (via drill 0.2)
  Top/HighSpeed 0.09: v16.79,26.41 v16.8,26.4 16.62,26.57 U7.7 | J9.H20 64.23,33.86 v63.9,34.2
  Bottom/LowSpeed 0.09: v63.9,34.2 63.6,34.5 39.1,34.5 33.05,40.55 24.65,40.55 20.4,36.3 14.9,36.3 9,30.4 9,26.4 9.7,25.7 16.1,25.7 v16.8,26.4
AIN_AOUT4  (via drill 0.2)
  Top/HighSpeed 0.09: v66.6,30.5 66.96,30.14 J9.F17 | U8.14 16.62,24.48 v16.6,24.5
  Bottom/LowSpeed 0.09: v66.6,30.5 66.8,30.7 66.8,33.2 65.2,34.8 39.3,34.8 33.25,40.85 24.55,40.85 20.3,36.6 14.8,36.6 8.7,30.5 8.7,26.3 9.6,25.4 15.8,25.4 16.6,24.6 v16.6,24.5
AIN_AOUT5  (via drill 0.2)
  Top/HighSpeed 0.09: v65.3,20.7 65.69,21.09 J9.G10 | U8.7 16.6,20.05 v16.6,19.42
  Bottom/LowSpeed 0.09: v65.3,20.7 64.9,20.3 62.3,20.3 58.85,16.85 58.85,13.96 58.6,13.71 58.6,9.9 57.8,9.1 36.2,9.1 33,5.9 18.1,5.9 12.6,11.4 12.6,17.2 13.85,18.45 15.85,18.45 16.6,19.2 v16.6,19.42
AIN_AOUT6  (via drill 0.2)
  Top/HighSpeed 0.09: v62.6,19.5 62.99,19.89 J9.J9 | v16.02,19.42 16.02,20.03 U8.6
  Bottom/LowSpeed 0.09: v62.6,19.5 60.15,17.05 60.15,10.25 58.7,8.8 36.3,8.8 33.1,5.6 18,5.6 12.3,11.3 12.3,17.5 13.67,18.87 15.66,18.87 16.02,19.23 v16.02,19.42
AIN_AOUT7  (via drill 0.2)